# Altium project SYNCBOX_V3I1.PrjPcb (part 2 of 5)

## Sheet [05] - POWER.SchDoc
size A2; Organization: Altium Limited; Address1: L3, 12a Rodborough Rd; Address2: Frenchs Forest; Address3: NSW; Address4: Australia 2086; DocumentNumber: 5; SheetNumber: 5; SheetTotal: 11
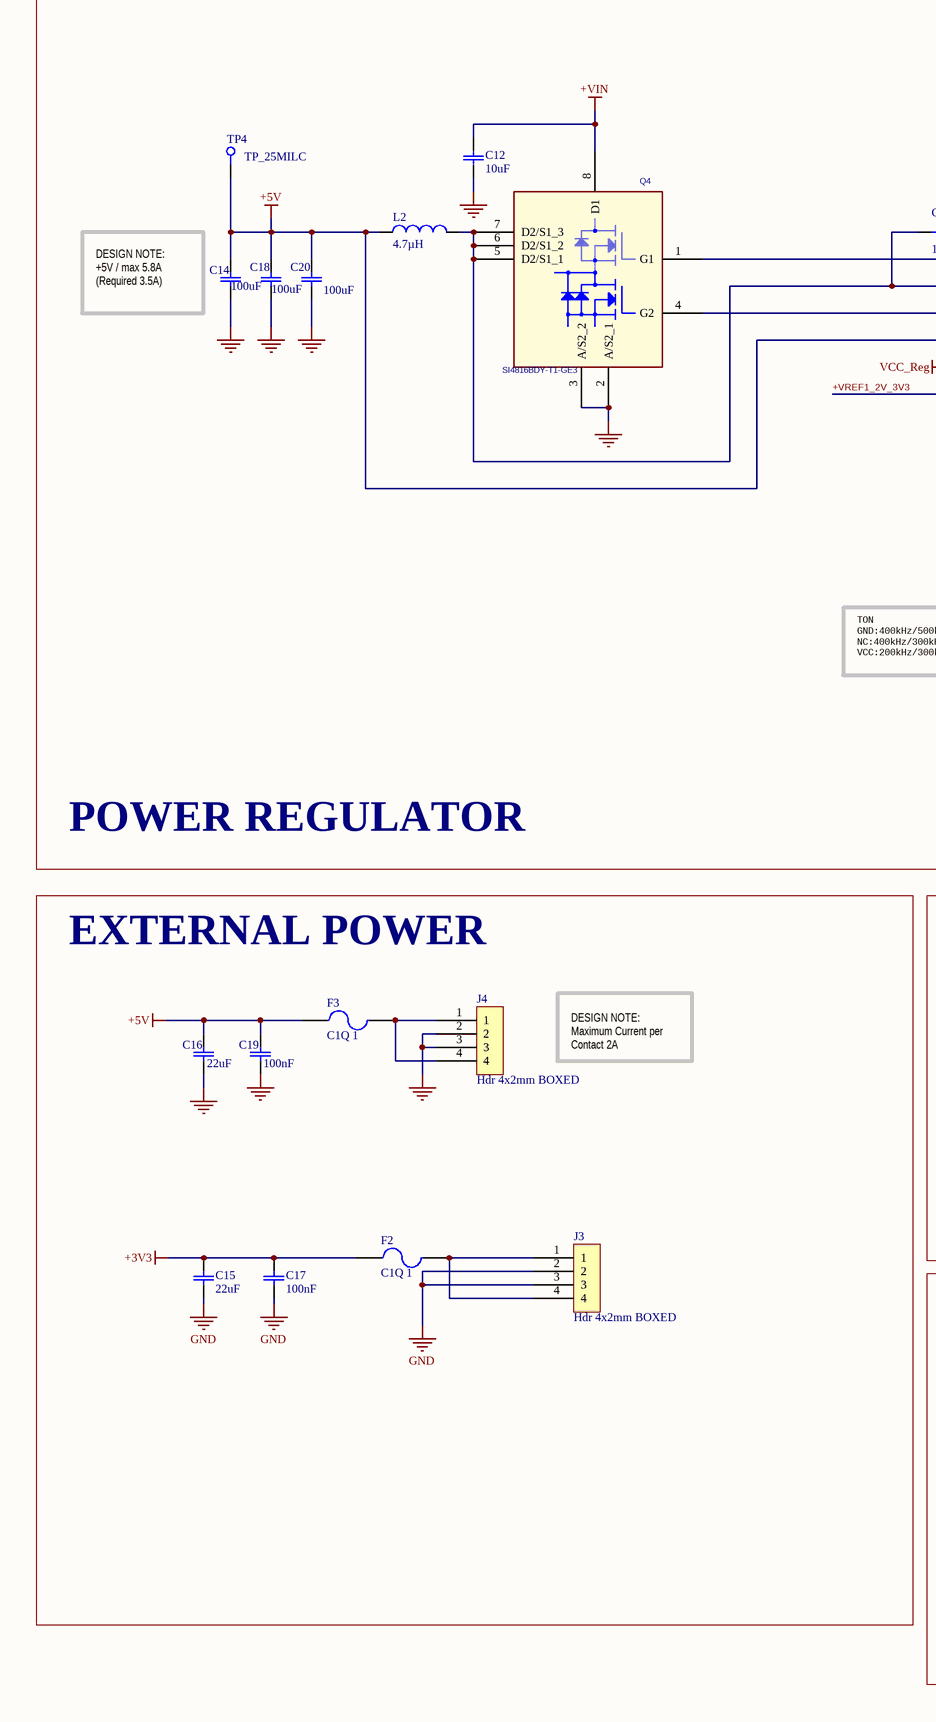
[diagram p4: [05] - POWER.SchDoc, left]
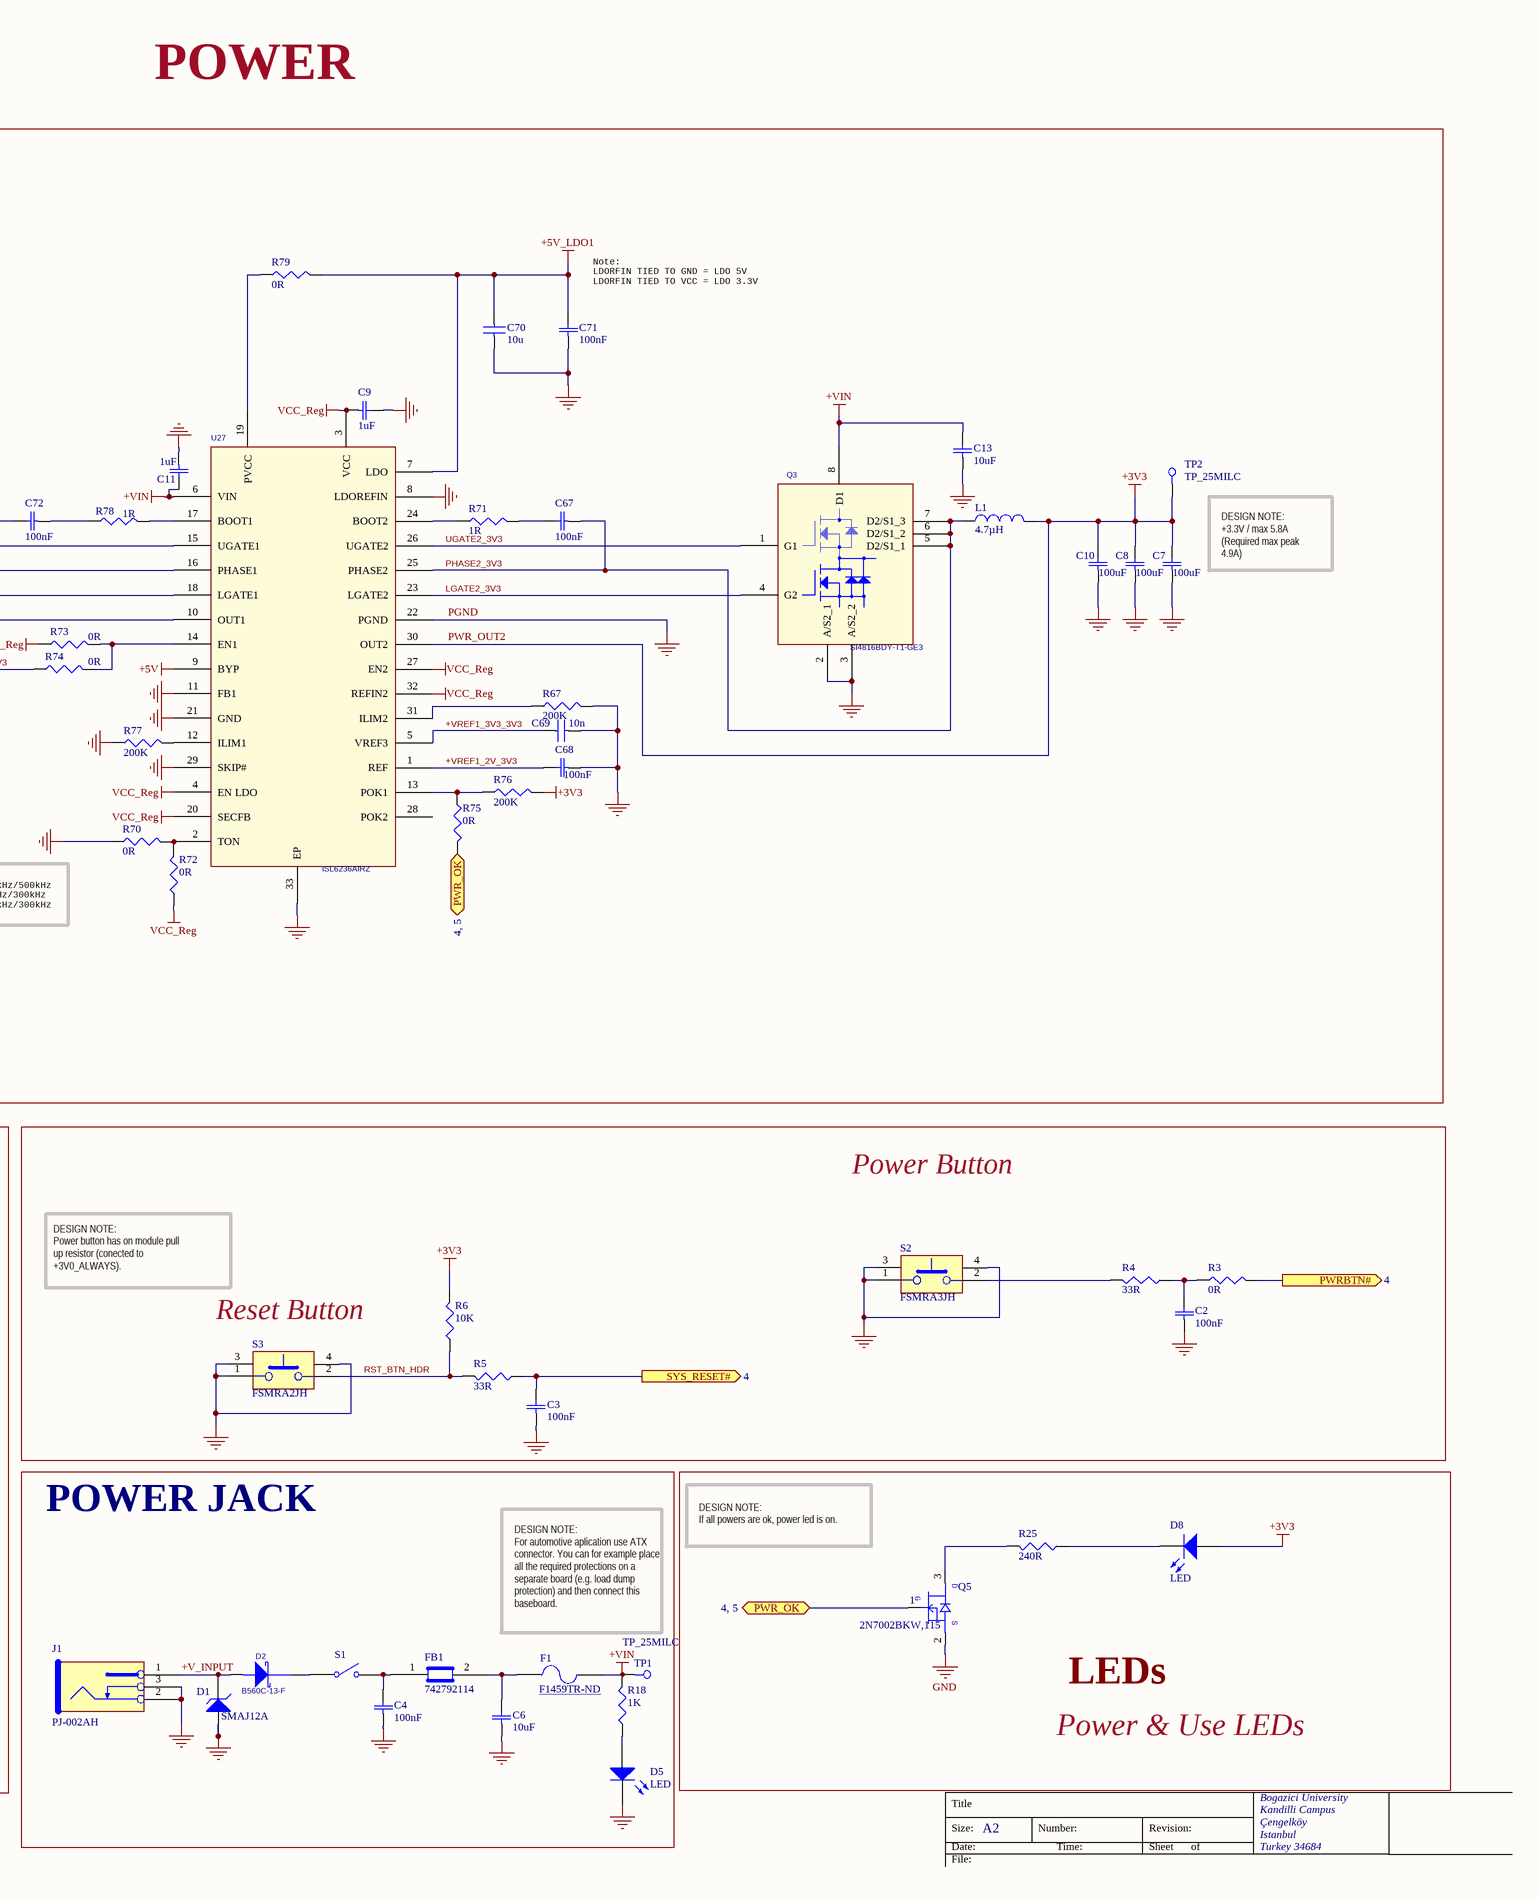
[diagram p5: [05] - POWER.SchDoc, right]

### Parts
(Parts that share a designator on the sheet are numbered #1, #2 ... from top to bottom, then left to right.)
C2#2  100nF  [C0402]
C3#2  100nF  [C0402]
C4#2  100nF  [C0402]
C6#2  10uF  [CAP_3216]
C7#2  100uF  [C1210C]
C8  100uF  [C1210C]
C9  1uF  [CAP_3216]
C10  100uF  [C1210C]
C11  1uF  [CAP_3216]
C12  10uF  [CAP_3216]
C13  10uF  [CAP_3216]
C14  100uF  [C1210C]
C15  22uF  [C0805]
C16  22uF  [C0805]
C17  100nF  [C0402]
C18  100uF  [C1210C]
C19  100nF  [C0402]
C20  100uF  [C1210C]
C67  100nF  [C0402]
C68  100nF  [C0402]
C69  10n  [C0402]
C70  10u  [C0603]
C71  100nF  [C0402]
C72  100nF  [C0402]
D1#2  SMAJ12A  [SMA / DO-214AC]
D2#2  B560C-13-F  [SMC]
D5  LED  [D0603_Directional]
D8  LED  [D0603_Directional]
F1  F1459TR-ND  [0466Series]
F2  C1Q 1  [C1]
F3  C1Q 1  [C1]
FB1  742792114  [Ferrite bead]
J1#2  PJ-002AH  [POWER_JACK_5.5_2.1MM_NS]
J3  Hdr 4x2mm BOXED  [HDR_1x4_2MM_SHDR]
J4  Hdr 4x2mm BOXED  [HDR_1x4_2MM_SHDR]
L1  4.7µH  [IHLP_255MILx270MIL]
L2  4.7µH  [IHLP_255MILx270MIL]
Q3  SI4816BDY-T1-GE3  [8_SOIC_3.9MM]
Q4  SI4816BDY-T1-GE3  [8_SOIC_3.9MM]
Q5  2N7002BKW,115  [SC70_SOT323]
R3#2  0R  [R0402]
R4#2  33R  [R0402]
R5#2  33R  [R0402]
R6  10K  [R0402]
R18  1K  [R0402]
R25  240R  [R0402]
R67  200K  [R0402]
R70  0R  [R0402]
R71  1R  [R0402]
R72  0R  [R0402]
R73  0R  [R0402]
R74  0R  [R0402]
R75  0R  [R0402]
R76  200K  [R0402]
R77  200K  [R0402]
R78  1R  [R0402]
R79  0R  [R0402]
S1#2  R1966ABLKBLKGR  [RockerSwitch]  (value not drawn)
S2  FSMRA3JH  [FSMRA3JH]
S3  FSMRA2JH  [FSMRA2JH]
TP1  TP_25MILC  [TP_25C]  (no BOM)
TP2  TP_25MILC  [TP_25C]  (no BOM)
TP4  TP_25MILC  [TP_25C]  (no BOM)
U27  ISL6236AIRZ  [32_VFQFN_EXPOSED_PAD]

### Blocks framed on the sheet
POWER REGULATOR: C7#2 C8-C14 C18 C20 C67-C72 L1 L2 Q3 Q4 R67 R70-R79 TP2 TP4 U27
EXTERNAL POWER: C15-C17 C19 F2 F3 J3 J4
POWER JACK: C4#2 C6#2 D1#2 D2#2 D5 F1 FB1 J1#2 R18 S1#2 TP1
LEDs: D8 Q5 R25

### Ports
PWR_OK (bidir, see 4, 5), PWRBTN# (out, see 4), SYS_RESET# (out, see 4)

### Nets
+5V: C14.2 C16.2 C18.2 C19.2 C20.2 F3.1 L2.1 TP4.1 U27.9(BYP) U27.10(OUT1)
+5V_LDO1: C70.1 C71.2 R79.2 U27.7(LDO)
+VIN: C11.2 C12.2 C13.2 F1.2 Q3.8(D1) Q4.8(D1) R18.2 TP1.1 U27.6(VIN)
GND: C2#2.1 C3#2.1 C4#2.1 C6#2.1 C7#2.1 C8.1 C9.2 C10.1 C11.1 C12.1 C13.1 C14.1 C15.1 C16.1 C17.1 C18.1 C19.1 C20.1 C68.1 C69.2 C70.2 C71.1 D1#2.1(A) D5.2(K) J1#2.2 J1#2.3 J3.2 J3.3 J4.2 J4.3 Q3.2(A/S2_1) Q3.3(A/S2_2) Q4.2(A/S2_1) Q4.3(A/S2_2) Q5.2(SOURCE) R67.2 R70.1 R77.1 S2.1 S2.3(MECH1) S2.4(MECH2) S3.1 S3.3(MECH1) S3.4(MECH2) U27.8(LDOREFIN) U27.11(FB1) U27.21(GND) U27.22(PGND) U27.29(SKIP#) U27.33(EP)  [also labelled PGND]
PWR_OUT2: C7#2.2 C8.2 C10.2 C15.2 C17.2 D8.1(A) F2.1 L1.2 R6.2 R76.2 TP2.1 U27.30(OUT2)  [also labelled +3V3]
VCC_Reg: C9.1 R72.1 R73.1 U27.3(VCC) U27.4(EN_LDO) U27.20(SECFB) U27.27(EN2) U27.32(REFIN2)
+V_INPUT: D1#2.2(K) D2#2.2(ANODE) J1#2.1
+VREF1_2V_3V3: C68.2 R74.1 U27.1(REF)
+VREF1_3V3_3V3: C69.1 U27.5(VREF3)
LGATE2_3V3: Q3.4(G2) U27.23(LGATE2)
PHASE2_3V3: C67.1 L1.1 Q3.5(D2/S1_1) Q3.6(D2/S1_2) Q3.7(D2/S1_3) U27.25(PHASE2)
RST_BTN_HDR: R5#2.2 R6.1 S3.2
UGATE2_3V3: Q3.1(G1) U27.26(UGATE2)
NetC2#2_2: C2#2.2 R3#2.1 R4#2.1
NetC3#2_2: C3#2.2 R5#2.1 ; port SYS_RESET#
NetC4#2_2: C4#2.2 FB1.1 S1#2.2(NO)
NetC6#2_2: C6#2.2 F1.1 FB1.2
NetC67_2: C67.2 R71.2
NetC72_1: C72.1 R78.1
NetC72_2: C72.2 L2.2 Q4.5(D2/S1_1) Q4.6(D2/S1_2) Q4.7(D2/S1_3) U27.16(PHASE1)
NetD2#2_1: D2#2.1(cathode) S1#2.1(COMMON)
NetD5_1: D5.1(A) R18.1
NetD8_2: D8.2(K) R25.1
NetF2_2: F2.2 J3.1 J3.4
NetF3_2: F3.2 J4.1 J4.4
NetJ8#1_B12: R3#2.2 ; port PWRBTN#
NetJ8#1_B24: Q5.1(GATE) R75.2 ; port PWR_OK
NetQ4_1: Q4.1(G1) U27.15(UGATE1)
NetQ4_4: Q4.4(G2) U27.18(LGATE1)
NetQ5_3: Q5.3(DRAIN) R25.2
NetR4#2_2: R4#2.2 S2.2
NetR67_1: R67.1 U27.31(ILIM2)
NetR70_2: R70.2 R72.2 U27.2(TON)
NetR71_1: R71.1 U27.24(BOOT2)
NetR73_2: R73.2 R74.2 U27.14(EN1)
NetR75_1: R75.1 R76.1 U27.13(POK1)
NetR77_2: R77.2 U27.12(ILIM1)
NetR78_2: R78.2 U27.17(BOOT1)
NetR79_1: R79.1 U27.19(PVCC)

Not connected (* = marked no-connect by the designer): U27 28(POK2)

### Notes on the sheet
- POWER
- (near C71) Note:
  LDORFIN TIED TO GND = LDO 5V
  LDORFIN TIED TO VCC = LDO 3.3V
- DESIGN NOTE:
  +3.3V / max 5.8A
  (Required max peak 4.9A)
- (near C14) DESIGN NOTE:
  +5V / max 5.8A
  (Required 3.5A)
- TON
  GND:400kHz/500kHz
  NC:400kHz/300kHz
  VCC:200kHz/300kHz
- Power Button
- DESIGN NOTE:
  Maximum Current per Contact 2A
- DESIGN NOTE:
  Power button has on module pull
  up resistor (conected to
  +3V0_ALWAYS).
- (near S3) Reset Button
- DESIGN NOTE:
  If all powers are ok, power led is on.
- DESIGN NOTE:
  For automotive aplication use ATX connector. You can for example place all the required protections on a separate board (e.g. load dump protection) and then connect this baseboard.
- Power & Use LEDs
- Title
- Bogazici University
- Size:
- Date:
- File:
- A2
- Number:
- Time:
- Revision:
- Sheet
- of
- Kandilli Campus
- Çengelköy
- Istanbul
- Turkey 34684
- (in symbol 2N7002BKW,115) D; G; S

### Library data of the parts
C2#2 C3#2 C4#2 C17 C19 C67 C68 C71 C72 = CL05A104KA5NNNC: CAP CER 0.1UF 50V X8R 0603; Manufacturer 1: Samsung Electro-Mechanics; Voltage - Rated: 25V; Tolerance: ±10%; Temperature Coefficient: X5R; Notification: Current market demand for these product types have resulted in fluctuating and extending lead times. Lead times may differ.; Description 1: CAP CER 0.1UF 25V X5R 0402; Category: Capacitors; Operating Temperature: -55°C ~ 85°C; Package / Case: 0402 (1005 Metric); Supplier 1: Digi-Key; Supplier Part Number 1: 1276-1043-6-ND; RoHS: RoHS Compliant; Stock 1: 100000; Pricing 1: 1=0.1, 10=0.04, 100=0.0176, 500=0.0126, 1000=0.0099, 2500=0.009, 5000=0.00828 (USD); Mounting Type: Surface Mount, MLCC; Applications: General Purpose; Ratings: -; Size / Dimension: 0.039" L x 0.020" W (1.00mm x 0.50mm); Height - Seated (Max): -; Thickness (Max): 0.022" (0.55mm); Lead Spacing: -; Features: -; Packaging: Digi-Reel®; Lead Style: -; ComponentLink1URL: http://www.samsungsem.com/kr/support/product-search/mlcc/CL05A104KA5NNNC.jsp; ComponentLink1Description: http://www.samsungsem.com/kr/support/product-search/mlcc/CL05A104KA5NNNC.jsp; Manufacturer Part Number 1: CL05A104KA5NNNC; Part Status: Active
C6#2 C12 C13 = C3216JB1V106K160: CAP CER 10UF 35V JB 1206; Manufacturer_Part_Number: C3216JB1V106K160AB; Manufacturer 1: TDK Corporation; Tolerance: ±10%; Vendor: TDK; Built_By: EMA_UL_Team; Type: DEV; C: Copyright (C) 2015 Accelerated Designs. All rights reserved; Notification: Current market demand for these product types have resulted in fluctuating and extending lead times. Lead times may differ.; Category: Capacitors; Operating Temperature: -25°C ~ 85°C; Package / Case: 1206 (3216 Metric); Value: Value; Voltage - Rated: 35V; Supplier 1: Digi-Key; Supplier Part Number 1: 445-11736-1-ND; RoHS: RoHS Compliant; Stock 1: 5285; Pricing 1: 1=0.92, 10=0.648, 100=0.4269, 500=0.31626, 1000=0.26881 (USD); Temperature Coefficient: JB; Mounting Type: Surface Mount, MLCC; Applications: General Purpose; Ratings: -; Size / Dimension: 0.126" L x 0.063" W (3.20mm x 1.60mm); Height - Seated (Max): -; Thickness (Max): 0.069" (1.75mm); Lead Spacing: -; Features: Low ESL; Packaging: Cut Tape (CT); Lead Style: -; ComponentLink1URL: https://product.tdk.com/info/en/catalog/datasheets/mlcc_commercial_general_en.pdf; ComponentLink1Description: https://product.tdk.com/info/en/catalog/datasheets/mlcc_commercial_general_en.pdf; RefDes: RefDes; Manufacturer Part Number 1: C3216JB1V106K160AB; Part Status: Active; Failure Rate: -; Description 1: CAP CER 10UF 35V JB 1206
C7#2 C8 C10 C14 C18 C20 = CL32A107MPVNNNE: CAP CER 100UF 10V X5R 1210; Manufacturer_Part_Number: C1210C107M8PACTU; Manufacturer 1: Samsung Electro-Mechanics; Tolerance: ±20%; Vendor: Kemet; Built_By: EMA_UL_Team; Type: DEV; C: Copyright (C) 2015 Accelerated Designs. All rights reserved; Notification: Current market demand for these product types have resulted in fluctuating and extending lead times. Lead times may differ.; Category: Capacitors; Operating Temperature: -55°C ~ 85°C; Package / Case: 1210 (3225 Metric); Value: 100uF; Voltage - Rated: 10V; Supplier 1: Digi-Key; Supplier Part Number 1: 1276-3364-1-ND; RoHS: RoHS Compliant; Stock 1: 10000; Pricing 1: 1=1.23, 10=0.97, 100=0.7277, 500=0.54984 (USD); Temperature Coefficient: X5R; Mounting Type: Surface Mount, MLCC; Applications: General Purpose; Ratings: -; Size / Dimension: 0.126" L x 0.098" W (3.20mm x 2.50mm); Height - Seated (Max): -; Thickness (Max): 0.110" (2.80mm); Lead Spacing: -; Features: -; Packaging: Cut Tape (CT); Lead Style: -; ComponentLink1URL: http://www.samsungsem.com/kr/support/product-search/mlcc/CL32A107MPVNNNE.jsp; ComponentLink1Description: http://www.samsungsem.com/kr/support/product-search/mlcc/CL32A107MPVNNNE.jsp; RefDes: RefDes; Manufacturer Part Number 1: CL32A107MPVNNNE; Part Status: Active; Description 1: CAP CER 100UF 10V X5R 1210
C9 = CGA5L3X8R1H105K1: CAP CER 1UF 50V X8R 1206; Manufacturer_Part_Number: CGA5L3X8R1H105K160AB; Manufacturer 1: TDK Corporation; Vendor: TDK; Built_By: EMA_UL_Team; Type: DEV; C: Copyright (C) 2015 Accelerated Designs. All rights reserved; Tolerance: ±10%; RefDes: RefDes; Value: Value; Manufacturer Part Number 1: CGA5L3X8R1H105K160AB; RoHS: RoHS Compliant; Stock 1: 3285; Pricing 1: 1=0.85, 10=0.628, 100=0.4306, 500=0.34086, 1000=0.28704 (USD); Packaging: Cut Tape (CT); Part Status: Active; Voltage - Rated: 50V; Temperature Coefficient: X8R; Operating Temperature: -55°C ~ 150°C; Features: High Temperature; Ratings: AEC-Q200; Applications: Automotive; Failure Rate: -; Mounting Type: Surface Mount, MLCC; Package / Case: 1206 (3216 Metric); Size / Dimension: 0.126" L x 0.063" W (3.20mm x 1.60mm); Height - Seated (Max): -; Thickness (Max): 0.071" (1.80mm); Lead Spacing: -; Lead Style: -; ComponentLink1URL: https://product.tdk.com/info/en/catalog/datasheets/mlcc_automotive_hightemp_en.pdf; ComponentLink1Description: https://product.tdk.com/info/en/catalog/datasheets/mlcc_automotive_hightemp_en.pdf; Supplier 1: Digi-Key; Supplier Part Number 1: 445-13000-1-ND; Description 1: CAP CER 1UF 50V X8R 1206; Category: Capacitors
C11 = CGA5L3X8R1H105K1: CAP CER 1UF 50V X8R 1206; Manufacturer_Part_Number: CGA5L3X8R1H105K160AB; Manufacturer 1: TDK Corporation; Tolerance: ±10%; Vendor: TDK; Built_By: EMA_UL_Team; Type: DEV; C: Copyright (C) 2015 Accelerated Designs. All rights reserved; Category: Capacitors; Operating Temperature: -55°C ~ 150°C; Package / Case: 1206 (3216 Metric); Value: Value; Voltage - Rated: 50V; Supplier 1: Digi-Key; Supplier Part Number 1: 445-13000-1-ND; RoHS: RoHS Compliant; Stock 1: 3285; Pricing 1: 1=0.85, 10=0.628, 100=0.4306, 500=0.34086, 1000=0.28704 (USD); Temperature Coefficient: X8R; Mounting Type: Surface Mount, MLCC; Applications: Automotive; Ratings: AEC-Q200; Size / Dimension: 0.126" L x 0.063" W (3.20mm x 1.60mm); Height - Seated (Max): -; Thickness (Max): 0.071" (1.80mm); Lead Spacing: -; Features: High Temperature; Packaging: Cut Tape (CT); Lead Style: -; ComponentLink1URL: https://product.tdk.com/info/en/catalog/datasheets/mlcc_automotive_hightemp_en.pdf; ComponentLink1Description: https://product.tdk.com/info/en/catalog/datasheets/mlcc_automotive_hightemp_en.pdf; RefDes: RefDes; Manufacturer Part Number 1: CGA5L3X8R1H105K160AB; Part Status: Active; Failure Rate: -; Description 1: CAP CER 1UF 50V X8R 1206
C15 C16 = CL21A226MOCLRNC: CAP CER 22UF 16V X5R 0805; Manufacturer 1: Samsung Electro-Mechanics; Tolerance: ±20%; Notification: Current market demand for these product types have resulted in fluctuating and extending lead times. Lead times may differ.; Supplier 1: Digi-Key; Supplier Part Number 1: 1276-6780-1-ND; RoHS: RoHS Compliant; Category: Capacitors; Stock 1: 40000; Pricing 1: 1=0.34, 10=0.233, 100=0.132, 500=0.09318, 1000=0.08153 (USD); Voltage - Rated: 16V; Temperature Coefficient: X5R; Mounting Type: Surface Mount, MLCC; Operating Temperature: -55°C ~ 85°C; Applications: General Purpose; Ratings: -; Package / Case: 0805 (2012 Metric); Size / Dimension: 0.079" L x 0.049" W (2.00mm x 1.25mm); Height - Seated (Max): -; Thickness (Max): 0.037" (0.95mm); Lead Spacing: -; Features: Low Profile; Packaging: Cut Tape (CT); Lead Style: -; ComponentLink1URL: http://www.samsungsem.com/kr/support/product-search/mlcc/CL21A226MOCLRNC.jsp; ComponentLink1Description: http://www.samsungsem.com/kr/support/product-search/mlcc/CL21A226MOCLRNC.jsp; Manufacturer Part Number 1: CL21A226MOCLRNC; Part Status: Active; Description 1: CAP CER 22UF 16V X5R 0805
C69 = C1005X7R1C103K: CAP CER 10000PF 16V X7R 10% 0402; Manufacturer: TDK Corporation; Value: 10nF; .Checked PCB: CHK; Capacitance: 10000pF; Category: Capacitors; Manufacturer Part Number: C1005X7R1C103K; Operating Temperature: -55°C ~ 125°C; Package / Case: 0402 (1005 Metric); Price 1k [$]: 0.00416; .Checked SCH: CHK; Voltage - Rated: 16V; Supplier Part Number: 445-1262-1-ND; Supplier: Digikey; Supplier 1: Digi-Key; Supplier Part Number 1: 445-1262-1-ND; RoHS: RoHS Compliant; Stock 1: 511497; Pricing 1: 1=0.08, 10=0.05, 100=0.018, 250=0.013, 500=0.0096, 1000=0.0065 (USD); Tolerance: ±10%; Temperature Coefficient: X7R; Mounting Type: Surface Mount, MLCC; Applications: General Purpose; Ratings: -; Size / Dimension: 0.039" L x 0.020" W (1.00mm x 0.50mm); Height - Seated (Max): -; Thickness (Max): 0.022" (0.55mm); Lead Spacing: -; Features: -; Packaging: Cut Tape (CT); Lead Style: -; ComponentLink1URL: http://www.tdk.co.jp/tefe02/e412_c.pdf; ComponentLink1Description: http://www.tdk.co.jp/tefe02/e412_c.pdf
C70 = C1608X5R0J106M: CAP CER 10UF 6.3V X5R 20% 0603; Manufacturer: TDK Corporation; Capacitance: 10µF; Value: 10µF; .Checked PCB: CHK; Category: Capacitors; Manufacturer Part Number: C1608X5R0J106M; Operating Temperature: -55°C ~ 85°C; Package / Case: 0603 (1608 Metric); Price 1k [$]: 0.08580; .Checked SCH: CHK; Voltage - Rated: 6.3V; Features: Low ESR; Supplier Part Number: 445-4112-1-ND; Supplier: Digikey; Supplier 1: Digi-Key; Supplier Part Number 1: 445-4112-1-ND; RoHS: RoHS Compliant; Stock 1: 48157; Pricing 1: 1=0.46, 10=0.363, 100=0.1898, 250=0.14024, 500=0.1089, 1000=0.0858 (USD); Tolerance: ±20%; Temperature Coefficient: X5R; Mounting Type: Surface Mount, MLCC; Applications: General Purpose; Ratings: -; Size / Dimension: 0.063" L x 0.031" W (1.60mm x 0.80mm); Height - Seated (Max): -; Thickness (Max): 0.037" (0.95mm); Lead Spacing: -; Packaging: Cut Tape (CT); Lead Style: -; ComponentLink1URL: http://www.tdk.com/pdf/general_B11.pdf; ComponentLink1Description: http://www.tdk.com/pdf/general_B11.pdf
D1#2 = SMAJ12A: TVS DIODE 12V 19.9V SMA; Manufacturer 1: Bourns Inc.; Type: Zener; Voltage - Breakdown (Min): 13.3V; Current - Peak Pulse (10/1000µs): 20.1A; Power - Peak Pulse: 400W; Power Line Protection: No; Supplier 1: Digi-Key; RoHS: RoHS Compliant; Category: Circuit Protection; Stock 1: 20326; Pricing 1: 1=0.47, 10=0.329, 25=0.27, 100=0.216, 250=0.15712, 500=0.12766, 1000=0.0982, 2500=0.08838 (USD); Packaging: Cut Tape (CT); Part Status: Active; Voltage - Reverse Standoff (Typ): 12V; Voltage - Clamping (Max) @ Ipp: 19.9V; Applications: General Purpose; Capacitance @ Frequency: -; Operating Temperature: -55°C ~ 150°C (TJ); Mounting Type: Surface Mount; Package / Case: DO-214AC, SMA; Supplier Device Package: SMA (DO-214AC); ComponentLink1URL: https://www.bourns.com/docs/Product-Datasheets/SMAJ.pdf; ComponentLink1Description: https://www.bourns.com/docs/Product-Datasheets/SMAJ.pdf; Supplier Part Number 1: SMAJ12ABCT-ND; Published: 8-Jun-2000; LatestRevisionDate: 17-Jul-2002; LatestRevisionNote: Re-released for DXP Platform.; PackageReference: DIODE-0.7; Publisher: Altium Limited; PackageDescription: Diode, Thru-Hole; 2 Leads; 0.7 in Pin Spacing; Manufacturer Part Number 1: SMAJ12A; Description 1: TVS DIODE 12V 19.9V SMA
D2#2 = B560C-13-F: DIODE SCHOTTKY 60V 5A SMC; Manufacturer: Diodes Inc; .Checked PCB: CHK; Voltage - Forward (Vf) (Max) @ If: 700mV @ 5A; Speed: Fast Recovery =< 500ns, > 200mA (Io); Current - Reverse Leakage @ Vr: 500µA @ 60V; Capacitance @ Vr, F: 300pF @ 4V, 1MHz; .Checked SCH: CHK; Category: Discrete Semiconductor Products; Supplier Part Number: B560C-FDICT-ND; Manufacturer Part Number: B560C-13-F; Price 1k [$]: 0.42900; Value: B560C-13-F; Package / Case: DO-214AB, SMC; Supplier: Digikey; Family: Diodes, Rectifiers - Single; Voltage - DC Reverse (Vr) (Max): 60V; Current - Average Rectified (Io): 5A; Diode Type: Schottky; Supplier 1: Digi-Key; Supplier Part Number 1: B560C-FDICT-ND; RoHS: RoHS Compliant; Stock 1: 37770; Pricing 1: 1=0.99, 10=0.884, 100=0.702, 250=0.611, 500=0.546, 1000=0.429 (USD); Reverse Recovery Time (trr): -; Mounting Type: Surface Mount; Supplier Device Package: SMC; Packaging: Cut Tape (CT); ComponentLink1URL: http://www.diodes.com/datasheets/ds13012.pdf; ComponentLink1Description: http://www.diodes.com/datasheets/ds13012.pdf
D5 D8 = LW Q38E-Q1OO-3K6L-1: LED COOL WHITE DIFFUSED 0603 SMD; Manufacturer 1: OSRAM Opto Semiconductors Inc.; Color: White, Cool; Lens Color: Yellow; Millicandela Rating: 81mcd; Lens Style/Size: Rectangle with Flat Top, 1.10mm x 0.80mm; Voltage - Forward (Vf) (Typ): 2.85V; Current - Test: 5mA; Viewing Angle: 150°, 130°; Wavelength - Dominant: 8200K; Supplier 1: Digi-Key; Supplier Part Number 1: 475-2831-1-ND; Manufacturer Part Number 1: LW Q38E-Q1OO-3K6L-1; RoHS: RoHS Compliant; Description 1: LED COOL WHITE DIFFUSED 0603 SMD; Category: Optoelectronics; Stock 1: 215520; Pricing 1: 1=0.49, 10=0.354, 25=0.2888, 100=0.231, 250=0.19492, 500=0.16604, 1000=0.12994 (USD); Packaging: Cut Tape (CT); Part Status: Active; Lens Transparency: Diffused; Mounting Type: Surface Mount; Wavelength - Peak: -; Features: -; Package / Case: 0603 (1608 Metric); Supplier Device Package: 0603; Size / Dimension: 1.60mm L x 0.80mm W; Height (Max): 0.40mm; ComponentLink1URL: https://dammedia.osram.info/media/resource/hires/osram-dam-2493068/LW%20Q38E.pdf; ComponentLink1Description: https://dammedia.osram.info/media/resource/hires/osram-dam-2493068/LW%20Q38E.pdf
F1 = 0466004.NR: FUSE BOARD MNT 4A 32VAC/VDC 1206; Manufacturer 1: Littelfuse Inc.; Manufacturer Part Number 1: 0466004.NRHF; Fuse Type: Board Mount (Cartridge Style Excluded); Response Time: Fast; Breaking Capacity @ Rated Voltage: 50A; Approvals: CSA, UL; Supplier 1: Digi-Key; Supplier Part Number 1: F6018DKR-ND; RoHS: RoHS Compliant; Description 1: FUSE BOARD MNT 4A 32VAC/VDC 1206; Category: Circuit Protection; Stock 1: 4728; Pricing 1: 1=0.84, 5=0.812, 10=0.787, 50=0.6618, 100=0.5493, 250=0.4994, 500=0.4245, 1000=0.37455 (USD); Packaging: Digi-Reel®; Part Status: Active; Package / Case: 1206 (3216 Metric); Mounting Type: Surface Mount; Operating Temperature: -55°C ~ 90°C; Color: -; Size / Dimension: 0.125" L x 0.060" W x 0.023" H (3.18mm x 1.52mm x 0.58mm); ComponentLink1URL: http://www.littelfuse.com/~/media/electronics/datasheets/fuses/littelfuse_fuse_466_datasheet.pdf.pdf; ComponentLink1Description: http://www.littelfuse.com/~/media/electronics/datasheets/fuses/littelfuse_fuse_466_datasheet.pdf.pdf
F2 F3 = C1Q 1: FUSE BOARD MOUNT 1A 125VAC 63VDC; Manufacturer 1: Bel Fuse Inc.; Fuse Type: Board Mount (Cartridge Style Excluded); Response Time: Fast; Breaking Capacity @ Rated Voltage: 100A AC, 50A DC; Approvals: CE, CSA, cULus; Supplier 1: Digi-Key; Supplier Part Number 1: 507-1077-1-ND; Manufacturer Part Number 1: C1Q 1; RoHS: RoHS Compliant; Description 1: FUSE BOARD MOUNT 1A 125VAC 63VDC; Category: Circuit Protection; Stock 1: 81500; Pricing 1: 1=0.33, 5=0.318, 10=0.304, 50=0.2714, 100=0.2526, 250=0.22452, 500=0.18712, 1000=0.17775 (USD); Packaging: Cut Tape (CT); Part Status: Active; Package / Case: 1206 (3216 Metric); Mounting Type: Surface Mount; Operating Temperature: -55°C ~ 125°C; Color: -; Size / Dimension: 0.126" L x 0.062" W x 0.023" H (3.20mm x 1.58mm x 0.58mm); ComponentLink1URL: https://belfuse.com/resources/datasheets/circuitprotection/ds-cp-c1q-series.pdf; ComponentLink1Description: https://belfuse.com/resources/datasheets/circuitprotection/ds-cp-c1q-series.pdf
FB1 = FB742792114: FERRITE BEAD 50 OHM 1206 1LN; Filter Type: Signal Line; Current Rating (Max): 3A; DC Resistance (DCR) (Max): 25 mOhm; .Checked PCB: CHK; Supplier 1: Digi-Key; Supplier Part Number 1: 732-1621-6-ND; Manufacturer 2: Wurth Electronics Inc.; Manufacturer Part Number 2: 742792114; RoHS: RoHS Compliant; Stock 2: 21934; Pricing 2: 1=0.24, 10=0.238, 50=0.219, 100=0.209, 500=0.2, 1000=0.19 (USD); Packaging: Cut Tape (CT); Part Status: Active; Ratings: -; Operating Temperature: -55°C ~ 125°C; Package / Case: 1206 (3216 Metric); Mounting Type: Surface Mount; Height (Max): 0.051" (1.30mm); Size / Dimension: 0.126" L x 0.063" W (3.20mm x 1.60mm); ComponentLink1URL: http://katalog.we-online.de/pbs/datasheet/742792114.pdf; ComponentLink1Description: http://katalog.we-online.de/pbs/datasheet/742792114.pdf; Supplier 2: Digi-Key; Supplier Part Number 2: 732-1621-1-ND; Description 2: FERRITE BEAD 50 OHM 1206 1LN; Category: Filters; .Checked SCH: CHK
J1#2 = PJ-002AH: CONN PWR JACK 2.1X5.5MM HIGH CUR; Manufacturer: CUI Inc; .Checked PCB: CHK; Mating connector: 2.1mm ID, 5.5mm OD; Gender: Male; Number of Positions/Contacts: 2 Conductors, 3 Contacts; Internal Switch(s): Single Switch, Normally Closed; Shielding: Unshielded; Voltage - Rated: 24VDC; Current Rating: 5A; .Checked SCH: CHK; Category: Connectors, Interconnects; Family: Barrel - Power; Manufacturer Part Number: PJ-002AH; Operating Temperature: -25°C ~ 85°C; Price 1k [$]: 0.23625; Supplier: Digikey; Supplier Part Number: CP-002AH-ND; Value: PJ-002AH; Supplier 1: Digi-Key; Supplier Part Number 1: CP-002AH-ND; RoHS: RoHS Compliant; Stock 1: 138933; Pricing 1: 1=1.01, 10=0.704, 100=0.4724, 500=0.3819, 1000=0.3417, 2500=0.27135 (USD); Connector Type: Jack; Plug/Mating Plug Diameter: 2.1mm ID, 5.5mm OD; Mounting Type: Through Hole, Right Angle; Termination: Solder Eyelet(s); Features: -; Color: Black; Contact Material: Copper Alloy; Contact Material - Plating: Nickel; Housing Color: Black; Housing Material: Thermoplastic; ComponentLink1URL: http://products.cui.com/GetSpecForDigiKey.aspx?MFGNum=PJ-002AH; ComponentLink1Description: http://products.cui.com/GetSpecForDigiKey.aspx?MFGNum=PJ-002AH
J3 J4 = 0532530470: CONN HEADER 4POS 2MM VERT TIN; Manufacturer: Molex Inc; Connector Type: Header, Shrouded; Number of Positions: 4; Number of Positions Loaded: All; Pitch: 0.079" (2.00mm); .Creator: MM; .Checked PCB: CHK; Supplier 1: Digi-Key; Manufacturer Part Number: 0532530470; RoHS: RoHS Compliant; Category: Connectors, Interconnects; Stock 1: 5160; Pricing 1: 1=0.23, 10=0.211, 50=0.1576, 100=0.1464, 250=0.12948, 500=0.12386, 1000=0.10134, 2500=0.0929, 5000=0.09008 (USD); Packaging: Tray; Contact Type: Male Pin; Number of Rows: 1; Row Spacing: -; Contact Mating Length: 0.130" (3.30mm); Mounting Type: Through Hole; Termination: Press-Fit; Fastening Type: -; Features: -; Contact Finish: Tin; Contact Finish Thickness: -; Color: -; ComponentLink1URL: http://www.molex.com/pdm_docs/sd/532530270_sd.pdf; ComponentLink1Description: http://www.molex.com/pdm_docs/sd/532530270_sd.pdf; Supplier Part Number 1: WM19006-ND; .Checked SCH: CHK
L1 L2 = IHLP2525CZER4R7M01: INDUCTOR POWER 4.7UH 5.5A SMD; Manufacturer: Vishay/Dale; .Checked PCB: CHK; Current - Saturation: 10A; Shielding: Shielded; DC Resistance (DCR): 40 mOhm Max; Tolerance: ±20%; Frequency - Test: 100kHz; .Checked SCH: CHK; Category: Inductors, Coils, Chokes; Manufacturer Part Number: IHLP2525CZER4R7M01; Operating Temperature: -55°C ~ 125°C; Package / Case: 0.270" L x 0.255" W x 0.118" H (6.86mm x 6.47mm x 3.00mm); Price 1k [$]: 1.09800; Value: 4.7µH; Inductance: 4.7µH; Current: 5.5A; Applications: General Purpose; Supplier Part Number: 541-1010-1-ND; Supplier: Digikey; Supplier 1: Digi-Key; Supplier Part Number 1: 541-1010-1-ND; RoHS: RoHS Compliant; Stock 1: 25684; Pricing 1: 1=2.26, 10=1.83, 100=1.525, 500=1.22, 1000=1.098 (USD); Current - Temperature Rise: 5.5A; Type: -; Q @ Freq: -; Frequency - Self Resonant: -; Material - Core: -; Mounting Type: Surface Mount; Packaging: Cut Tape (CT); ComponentLink1URL: http://www.vishay.com/doc?34104; ComponentLink1Description: http://www.vishay.com/doc?34104
Q3 Q4 = SI4816BDY-T1-GE3: MOSFET DL N-CH 30V 6.8A 8-SOIC; Manufacturer: Vishay/Siliconix; .Checked PCB: CHK; FET Type: 2 N-Channel (Dual); FET Feature: Logic Level Gate; Rds On (Max) @ Id, Vgs: 18.5 mOhm @ 6.8A, 10V; Current - Continuous Drain (Id) @ 25° C: 5.8A, 8.2A; Vgs(th) (Max) @ Id: 3V @ 250µA; Power - Max: 1W, 1.25W; Gate Charge (Qg) @ Vgs: 10nC @ 5V; .Checked SCH: CHK; Category: Discrete Semiconductor Products; Manufacturer Part Number: SI4816BDY-T1-GE3; Package / Case: 8-SOIC (0.154", 3.90mm Width); Price 1k [$]: 0.84800; Value: SI4816BDY-T1-GE3; Family: FETs - Arrays; Drain to Source Voltage (Vdss): 30V; Supplier Part Number: SI4816BDY-T1-GE3CT-ND; Supplier: Digikey; Supplier 1: Digi-Key; Supplier Part Number 1: SI4816BDY-T1-GE3CT-ND; RoHS: RoHS Compliant; Stock 1: 15735; Pricing 1: 1=1.84, 25=1.4228, 100=1.2912, 250=1.1594, 500=1.0013, 1000=0.8432 (USD); Input Capacitance (Ciss) @ Vds: -; Mounting Type: Surface Mount; Supplier Device Package: 8-SOICN; Packaging: Cut Tape (CT); ComponentLink1URL: http://www.vishay.com/docs/73026/si4816bd.pdf; ComponentLink1Description: http://www.vishay.com/docs/73026/si4816bd.pdf
Q5 = 2N7002BKW,115: MOSFET N-CH 60V 310MA SOT323; Manufacturer: NXP Semiconductors; FET Type: MOSFET N-Channel, Metal Oxide; FET Feature: Logic Level Gate; Rds On (Max) @ Id, Vgs: 1.6 Ohm @ 500mA, 10V; Vgs(th) (Max) @ Id: 2.1V @ 250µA; Gate Charge (Qg) @ Vgs: 0.6nC @ 4.5V; Input Capacitance (Ciss) @ Vds: 50pF @ 10V; Power - Max: 275mW; .Checked PCB: CHK; Supplier 1: Digi-Key; Supplier Part Number 1: 568-5980-1-ND; Manufacturer Part Number: 2N7002BKW,115; RoHS: RoHS Compliant; Category: Discrete Semiconductor Products; Stock 1: 15666; Pricing 1: 1=0.39, 10=0.354, 25=0.2548, 100=0.1983, 250=0.12456, 500=0.10616, 1000=0.07233 (USD); Drain to Source Voltage (Vdss): 60V; Current - Continuous Drain (Id) @ 25° C: 310mA; Mounting Type: Surface Mount; Package / Case: SC-70, SOT-323; Supplier Device Package: SC-70; Packaging: Cut Tape (CT); ComponentLink1URL: http://www.nxp.com/documents/data_sheet/2N7002BKW.pdf; ComponentLink1Description: http://www.nxp.com/documents/data_sheet/2N7002BKW.pdf; .Checked SCH: CHK
R3#2 R70 R72-R75 R79 = RC1005J000CS: RES SMD 0 OHM JUMPER 1/16W 0402; Manufacturer 1: Samsung Electro-Mechanics; Power (Watts): 0.063W, 1/16W; .Checked PCB: used; Category: Resistors; Package / Case: 0402 (1005 Metric); Tolerance: Jumper; .Checked SCH: used; Supplier 1: Digi-Key; Supplier Part Number 1: 1276-3480-6-ND; RoHS: RoHS Compliant; Stock 1: 9624698; Pricing 1: 1=0.1, 10=0.016, 25=0.0116, 50=0.009, 100=0.0066, 250=0.005, 500=0.004, 1000=0.00295, 5000=0.00211 (USD); Composition: Thick Film; Features: Moisture Resistant; Temperature Coefficient: -; Size / Dimension: 0.039" L x 0.020" W (1.00mm x 0.50mm); Packaging: Digi-Reel®; ComponentLink1URL: http://www.samsungsem.com/kr/support/product-search/chip-resistor/RC1005J000CS.jsp; ComponentLink1Description: http://www.samsungsem.com/kr/support/product-search/chip-resistor/RC1005J000CS.jsp; Manufacturer Part Number 1: RC1005J000CS; Part Status: Active; Operating Temperature: -55°C ~ 155°C; Supplier Device Package: 0402; Height - Seated (Max): 0.016" (0.40mm); Failure Rate: -; Description 1: RES SMD 0 OHM JUMPER 1/16W 0402
R4#2 R5#2 = ERJ-2RKF33R0X: RES SMD 33 OHM 1% 1/10W 0402; Manufacturer 1: Panasonic Electronic Components; Power (Watts): 0.1W, 1/10W; .Checked PCB: RF; Temperature Coefficient: ±100ppm/°C; Category: Resistors; Package / Case: 0402 (1005 Metric); Tolerance: ±1%; .Checked SCH: RF; Supplier 1: Digi-Key; Supplier Part Number 1: P33.0LDKR-ND; RoHS: RoHS Compliant; Stock 1: 459707; Pricing 1: 1=0.1, 10=0.056, 100=0.0227, 1000=0.01021, 2500=0.00886, 5000=0.00732 (USD); Composition: Thick Film; Features: Automotive AEC-Q200; Size / Dimension: 0.039" L x 0.020" W (1.00mm x 0.50mm); Packaging: Digi-Reel®; ComponentLink1URL: https://industrial.panasonic.com/cdbs/www-data/pdf/RDA0000/AOA0000C304.pdf; ComponentLink1Description: https://industrial.panasonic.com/cdbs/www-data/pdf/RDA0000/AOA0000C304.pdf; Manufacturer Part Number 1: ERJ-2RKF33R0X; Part Status: Active; Operating Temperature: -55°C ~ 155°C; Supplier Device Package: 0402; Height - Seated (Max): 0.016" (0.40mm); Failure Rate: -; Description 1: RES SMD 33 OHM 1% 1/10W 0402
R6 = RC1005F103CS: RES SMD 10K OHM 1% 1/16W 0402; Manufacturer 1: Samsung Electro-Mechanics; Power (Watts): 0.063W, 1/16W; .Checked PCB: used; Temperature Coefficient: ±100ppm/°C; Category: Resistors; Package / Case: 0402 (1005 Metric); Tolerance: ±1%; .Checked SCH: used; Supplier 1: Digi-Key; Supplier Part Number 1: 1276-3431-6-ND; RoHS: RoHS Compliant; Stock 1: 12738811; Pricing 1: 1=0.1, 10=0.021, 100=0.0087, 1000=0.00391, 2500=0.00339, 5000=0.0028 (USD); Composition: Thick Film; Features: Moisture Resistant; Size / Dimension: 0.039" L x 0.020" W (1.00mm x 0.50mm); Packaging: Digi-Reel®; ComponentLink1URL: http://www.samsungsem.com/kr/support/product-search/chip-resistor/RC1005F103CS.jsp; ComponentLink1Description: http://www.samsungsem.com/kr/support/product-search/chip-resistor/RC1005F103CS.jsp; Manufacturer Part Number 1: RC1005F103CS; Part Status: Active; Operating Temperature: -55°C ~ 155°C; Supplier Device Package: 0402; Height - Seated (Max): 0.016" (0.40mm); Failure Rate: -; Description 1: RES SMD 10K OHM 1% 1/16W 0402
R18 = ERJ-2RKF1001X: RES SMD 1K OHM 1% 1/10W 0402; Manufacturer 1: Panasonic Electronic Components; .Checked PCB: used; Power (Watts): 0.1W, 1/10W; Temperature Coefficient: ±100ppm/°C; .Checked SCH: used; Manufacturer Part Number 1: ERJ-2RKF1001X; RoHS: RoHS Compliant; Stock 1: 18630560; Pricing 1: 1=0.1, 10=0.056, 100=0.0227, 1000=0.01021, 2500=0.00886, 5000=0.00732 (USD); Packaging: Digi-Reel®; Part Status: Active; Tolerance: ±1%; Composition: Thick Film; Features: Automotive AEC-Q200; Operating Temperature: -55°C ~ 155°C; Package / Case: 0402 (1005 Metric); Supplier Device Package: 0402; Size / Dimension: 0.039" L x 0.020" W (1.00mm x 0.50mm); Height - Seated (Max): 0.016" (0.40mm); Failure Rate: -; ComponentLink1URL: https://industrial.panasonic.com/cdbs/www-data/pdf/RDA0000/AOA0000C304.pdf; ComponentLink1Description: https://industrial.panasonic.com/cdbs/www-data/pdf/RDA0000/AOA0000C304.pdf; Supplier 1: Digi-Key; Supplier Part Number 1: P1.00KLDKR-ND; Description 1: RES SMD 1K OHM 1% 1/10W 0402; Category: Resistors
R25 = RMCF0402FT240R: RES TF 240 OHM 1% 0.0625W 0402; Manufacturer: Stackpole Electronics Inc; Resistance (Ohms): 240; Power (Watts): 0.063W, 1/16W; .Checked PCB: CHK; Temperature Coefficient: ±100ppm/°C; Category: Resistors; Supplier Part Number: RMCF0402FT240RCT-ND; Manufacturer Part Number: RMCF0402FT240R; Package / Case: 0402 (1005 Metric); Price 1k [$]: 0.00384; Tolerance: ±1%; Value: 240R; .Checked SCH: CHK; Supplier: Digikey; Supplier 1: Digi-Key; Supplier Part Number 1: RMCF0402FT240RCT-ND; RoHS: RoHS Compliant; Stock 1: 39860; Pricing 1: 1=0.04, 10=0.025, 50=0.0138, 100=0.0105, 250=0.0078, 500=0.00576, 1000=0.00384 (USD); Composition: Thick Film; Features: -; Size / Dimension: 0.039" L x 0.020" W (1.00mm x 0.50mm); Height: 0.016" (0.40mm); Number of Terminations: 2; Packaging: Cut Tape (CT); ComponentLink1URL: http://www.seielect.com/Catalog/SEI-RMCF.pdf; ComponentLink1Description: http://www.seielect.com/Catalog/SEI-RMCF.pdf
R67 R76 R77 = RC1005F204CS: RES SMD 200K OHM 1% 1/16W 0402; Manufacturer 1: Samsung Electro-Mechanics; Power (Watts): 0.063W, 1/16W; .Checked PCB: used; Temperature Coefficient: ±100ppm/°C; Category: Resistors; Package / Case: 0402 (1005 Metric); Tolerance: ±1%; .Checked SCH: used; Supplier 1: Digi-Key; Supplier Part Number 1: 1276-3449-6-ND; RoHS: RoHS Compliant; Stock 1: 325433; Pricing 1: 1=0.1, 10=0.021, 100=0.0087, 1000=0.00391, 2500=0.00339, 5000=0.0028 (USD); Composition: Thick Film; Features: Moisture Resistant; Size / Dimension: 0.039" L x 0.020" W (1.00mm x 0.50mm); Packaging: Digi-Reel®; ComponentLink1URL: http://www.samsungsem.com/kr/support/product-search/chip-resistor/RC1005F204CS.jsp; ComponentLink1Description: http://www.samsungsem.com/kr/support/product-search/chip-resistor/RC1005F204CS.jsp; Manufacturer Part Number 1: RC1005F204CS; Part Status: Active; Operating Temperature: -55°C ~ 155°C; Supplier Device Package: 0402; Height - Seated (Max): 0.016" (0.40mm); Failure Rate: -; Description 1: RES SMD 200K OHM 1% 1/16W 0402
R71 R78 = RC0402FR-071RL: RES 1.00 OHM 1/16W 1% 0402 SM; Manufacturer: Yageo; Resistance (Ohms): 1; Power (Watts): 0.063W, 1/16W; .Checked PCB: CHK; Temperature Coefficient: ±200ppm/°C; Category: Resistors; Manufacturer Part Number: RC0402FR-071RL; Package / Case: 0402 (1005 Metric); Price 1k [$]: 0.01421; Tolerance: ±1%; Value: 1R; .Checked SCH: CHK; Supplier Part Number: 311-1.00LRCT-ND; Supplier: Digikey; Supplier 1: Digi-Key; Supplier Part Number 1: 311-1.00LRCT-ND; RoHS: RoHS Compliant; Stock 1: 347765; Pricing 1: 10=0.019, 50=0.0142, 100=0.0109, 250=0.00808, 500=0.00596, 1000=0.00397 (USD); Composition: Thick Film; Features: -; Size / Dimension: 0.039" L x 0.020" W (1.00mm x 0.50mm); Height: 0.016" (0.40mm); Number of Terminations: 2; Packaging: Cut Tape (CT); ComponentLink1URL: http://www.yageo.com/documents/recent/PYu-RC0402_51_RoHS_L_6.pdf; ComponentLink1Description: http://www.yageo.com/documents/recent/PYu-RC0402_51_RoHS_L_6.pdf
S1#2 = R1966ABLKBLKGR: SWITCH ROCKER SPST 15A 125V; Manufacturer 1: E-Switch; Switch Function: On-Off; Current Rating: 15A (AC); Actuator Type: Concave (Curved); Color - Actuator/Cap: Black; Actuator Marking: O I; Mechanical Life: 30,000 Cycles; Electrical Life: 10,000 Cycles; Supplier 1: Digi-Key; Supplier Part Number 1: EG2578-ND; Manufacturer Part Number 1: R1966ABLKBLKGR; RoHS: RoHS Compliant; Description 1: SWITCH ROCKER SPST 15A 125V; Category: Switches; Stock 1: 9; Pricing 1: 1=1.58, 10=1.507, 25=1.4384, 50=1.37, 100=1.3015, 250=1.26724, 500=1.19876, 1000=1.06175, 5000=1.0275 (USD); Packaging: Bulk; Part Status: Active; Circuit: SPST; Illumination Type, Color: -; Illumination Voltage (Nominal): -; Mounting Type: Panel Mount, Snap-In, Right Angle; Termination Style: PC Pin; Ingress Protection: -; Features: -; Panel Cutout Dimensions: Rectangular - 19.40mm x 13.00mm; Operating Temperature: -30°C ~ 65°C; ComponentLink1URL: http://spec_sheets.e-switch.com/specs/M301223.pdf; ComponentLink1Description: http://spec_sheets.e-switch.com/specs/M301223.pdf; Published: 24-Mar-1999; LatestRevisionDate: 17-Jul-2002; LatestRevisionNote: Re-released for DXP Platform.; PackageReference: SPST-2; Publisher: Altium Limited; PackageDescription: Switch; 2 Leads
S2 = FSMRA3JH: SWITCH TACTILE SPST-NO 0.05A 12V; Manufacturer: TE Connectivity; Switch Function: Off-Mom; Contact Rating @ Voltage: 0.05A @ 12VDC; Actuator Type: Standard; Actuator Height off PCB, from Pins: 5.85mm; Actuator Orientation: Side Actuated; Outline: 7.10mm x 7.00mm; Illumination: Non-Illuminated; Operating Force: 160gf; Actuator Material: Polyamide (PA), Nylon; Switch Travel: 0.25mm; Mechanical Life: 100,000 Cycles; .Creator: MM; .Checked PCB: CHK; Supplier 1: Digi-Key; Manufacturer Part Number: FSMRA3JH; RoHS: RoHS Compliant; Category: Switches; Stock 1: 37985; Pricing 1: 1=0.15, 10=0.143, 25=0.1376, 50=0.1328, 100=0.1255, 250=0.11808, 500=0.11316, 1000=0.0861 (USD); Packaging: Bulk; Circuit: SPST-NO; Mounting Type: Through Hole, Right Angle; Termination Style: PC Pin; Illumination Voltage (Nominal): -; Illumination Type, Color: -; Ingress Protection: -; Features: -; Operating Temperature: -35°C ~ 85°C; ComponentLink1URL: http://www.te.com/commerce/DocumentDelivery/DDEController?Action=srchrtrv&DocNm=1825027&DocType=Customer+Drawing&DocLang=English; ComponentLink1Description: http://www.te.com/commerce/DocumentDelivery/DDEController?Action=srchrtrv&DocNm=1825027&DocType=Customer+Drawing&DocLang=English; Supplier Part Number 1: 450-1657-ND; .Checked SCH: CHK
S3 = FSMRA2JH: SWITCH TACTILE SPST-NO 0.05A 24V; Manufacturer 1: TE Connectivity ALCOSWITCH Switches; Manufacturer Part Number 1: 1825027-5; .Checked PCB: MM; Switch Function: Off-Mom; Contact Rating @ Voltage: 0.05A @ 24VDC; Actuator Type: Standard; Actuator Length, Right Angle: 3.86mm; Actuator Orientation: Side Actuated; Outline: 7.10mm x 7.00mm; Illumination: Non-Illuminated; Operating Force: 160gf; Actuator Material: Polybutylene Terephthalate (PBT); Switch Travel: 0.25mm; Mechanical Life: 100,000 Cycles; .Checked SCH: MM; RoHS: RoHS Compliant; Stock 1: 37455; Pricing 1: 1=0.17, 10=0.169, 25=0.1628, 50=0.157, 100=0.1482, 250=0.13952, 500=0.1337, 1000=0.10173, 5000=0.08429 (USD); Packaging: Bulk; Part Status: Active; Circuit: SPST-NO; Mounting Type: Through Hole, Right Angle; Actuator Height off PCB, Vertical: -; Termination Style: PC Pin; Illumination Type, Color: -; Illumination Voltage (Nominal): -; Ingress Protection: -; Features: -; Operating Temperature: -35°C ~ 85°C; ComponentLink1URL: http://www.te.com/commerce/DocumentDelivery/DDEController?Action=srchrtrv&DocNm=1825027&DocType=Customer+Drawing&DocLang=English; ComponentLink1Description: http://www.te.com/commerce/DocumentDelivery/DDEController?Action=srchrtrv&DocNm=1825027&DocType=Customer+Drawing&DocLang=English; Supplier 1: Digi-Key; Supplier Part Number 1: 450-1662-ND; Description 1: SWITCH TACTILE SPST-NO 0.05A 24V; Category: Switches
TP1 TP2 TP4 = TP_25MILC: Test Point 25mil; .Checked PCB: CHK; .Checked SCH: CHK
U27 = ISL6236AIRZ: IC MAIN PWR CTRLR QUAD 32-QFN; Manufacturer: Intersil; .Checked PCB: CHK; Voltage - Input: 4.5 V ~ 25 V; Number of Outputs: 4; Voltage - Output: Multiple; .Checked SCH: CHK; Category: Integrated Circuits (ICs); Manufacturer Part Number: ISL6236AIRZ; Operating Temperature: -40°C ~ 100°C; Package / Case: 32-VFQFN Exposed Pad; Price 1k [$]: 3.0840; Value: ISL6236AIRZ; Family: PMIC - Voltage Regulators - Special Purpose; Supplier Part Number: ISL6236AIRZ-ND; Supplier: Digikey; Supplier 1: Digi-Key; Supplier Part Number 1: ISL6236AIRZ-ND; RoHS: RoHS Compliant; Stock 1: 0; Pricing 1: 600=4.28 (USD); Applications: Controller, Notebook Power System; Mounting Type: Surface Mount; Supplier Device Package: 32-QFN Exposed Pad (5x5); Packaging: Tube; ComponentLink1URL: http://www.intersil.com/data/fn/fn6453.pdf; ComponentLink1Description: http://www.intersil.com/data/fn/fn6453.pdf

## Sheet [06] - MICRO CONTROLLER CONNECTORS.SchDoc
size A1; Organization: Altium Limited; Address1: L3, 12a Rodborough Rd; Address2: Frenchs Forest; Address3: NSW; Address4: Australia 2086; DocumentNumber: 6; SheetNumber: 6; SheetTotal: 11
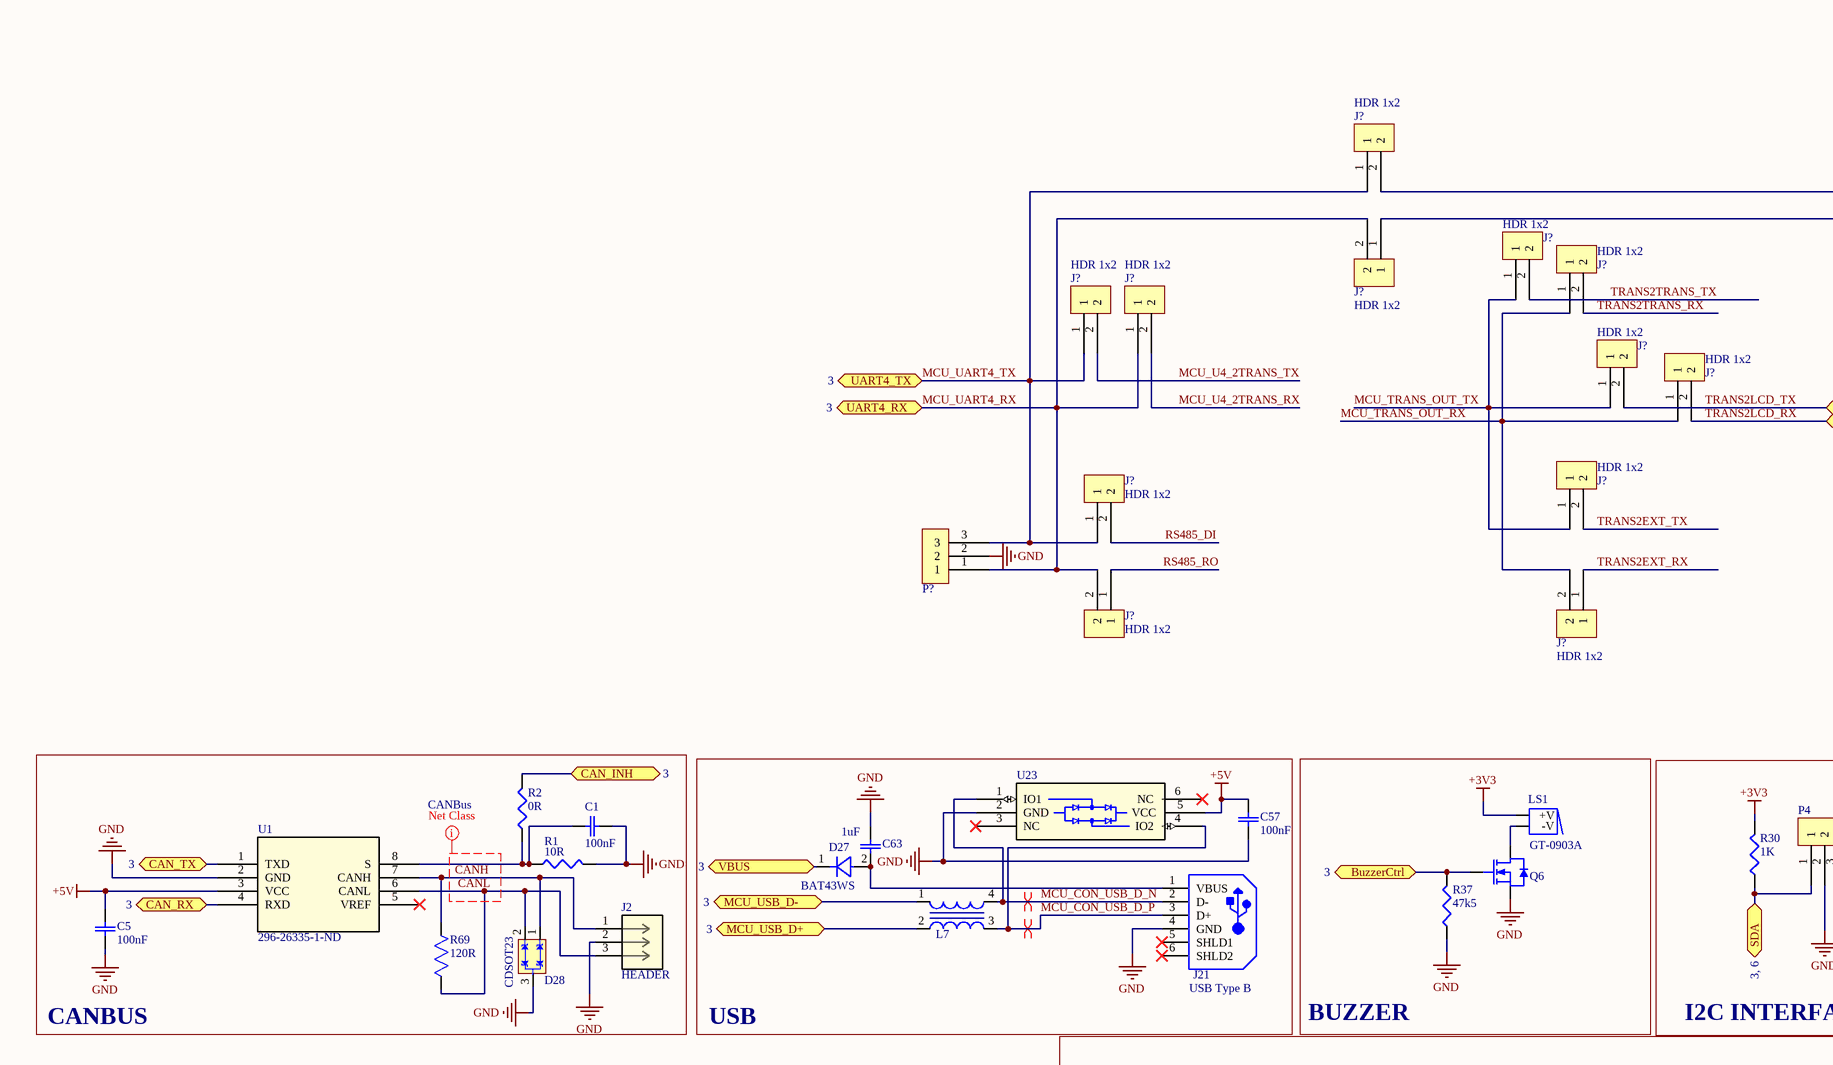
[diagram p6: [06] - MICRO CONTROLLER CONNECTORS.SchDoc, top left]
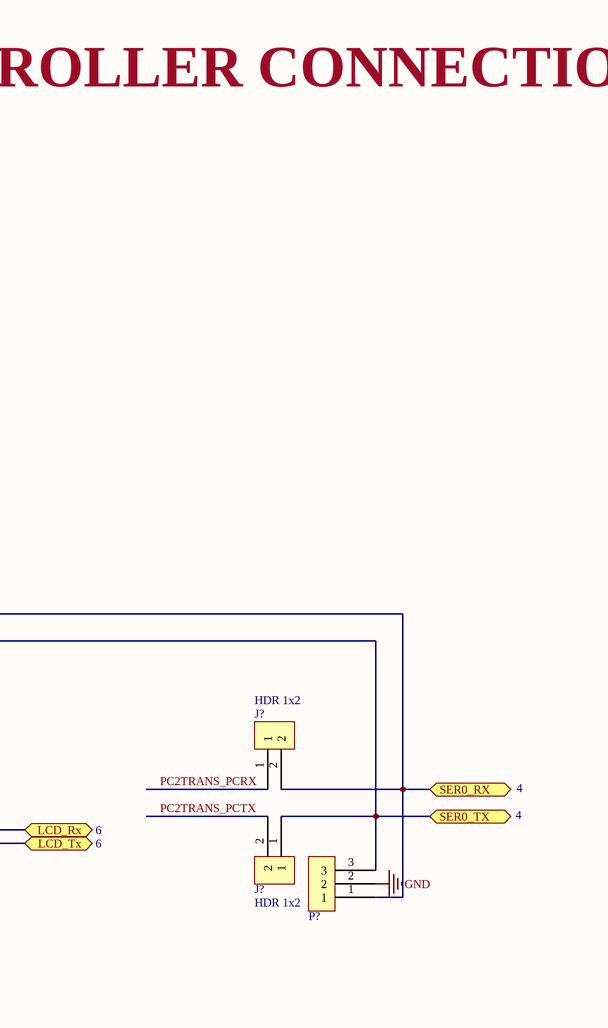
[diagram p7: [06] - MICRO CONTROLLER CONNECTORS.SchDoc, top right]
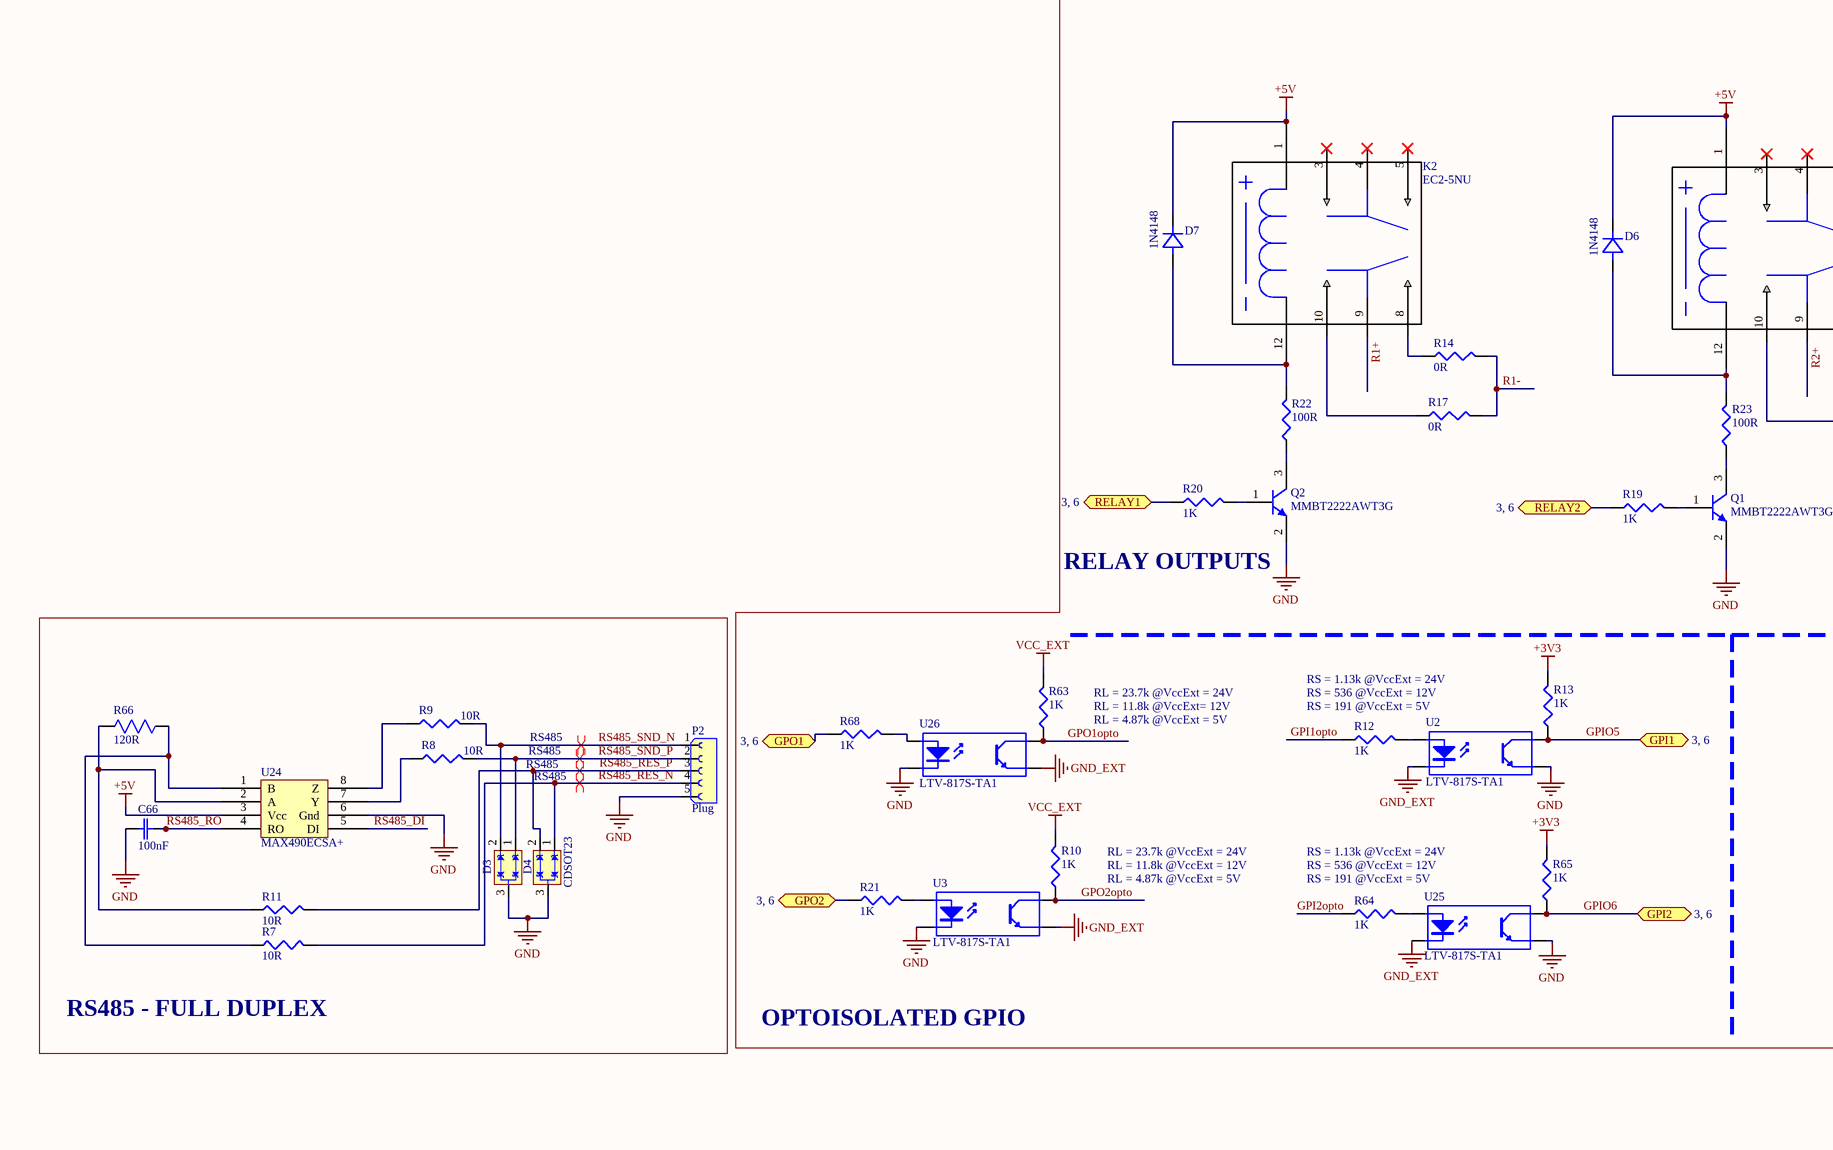
[diagram p8: [06] - MICRO CONTROLLER CONNECTORS.SchDoc, bottom left]
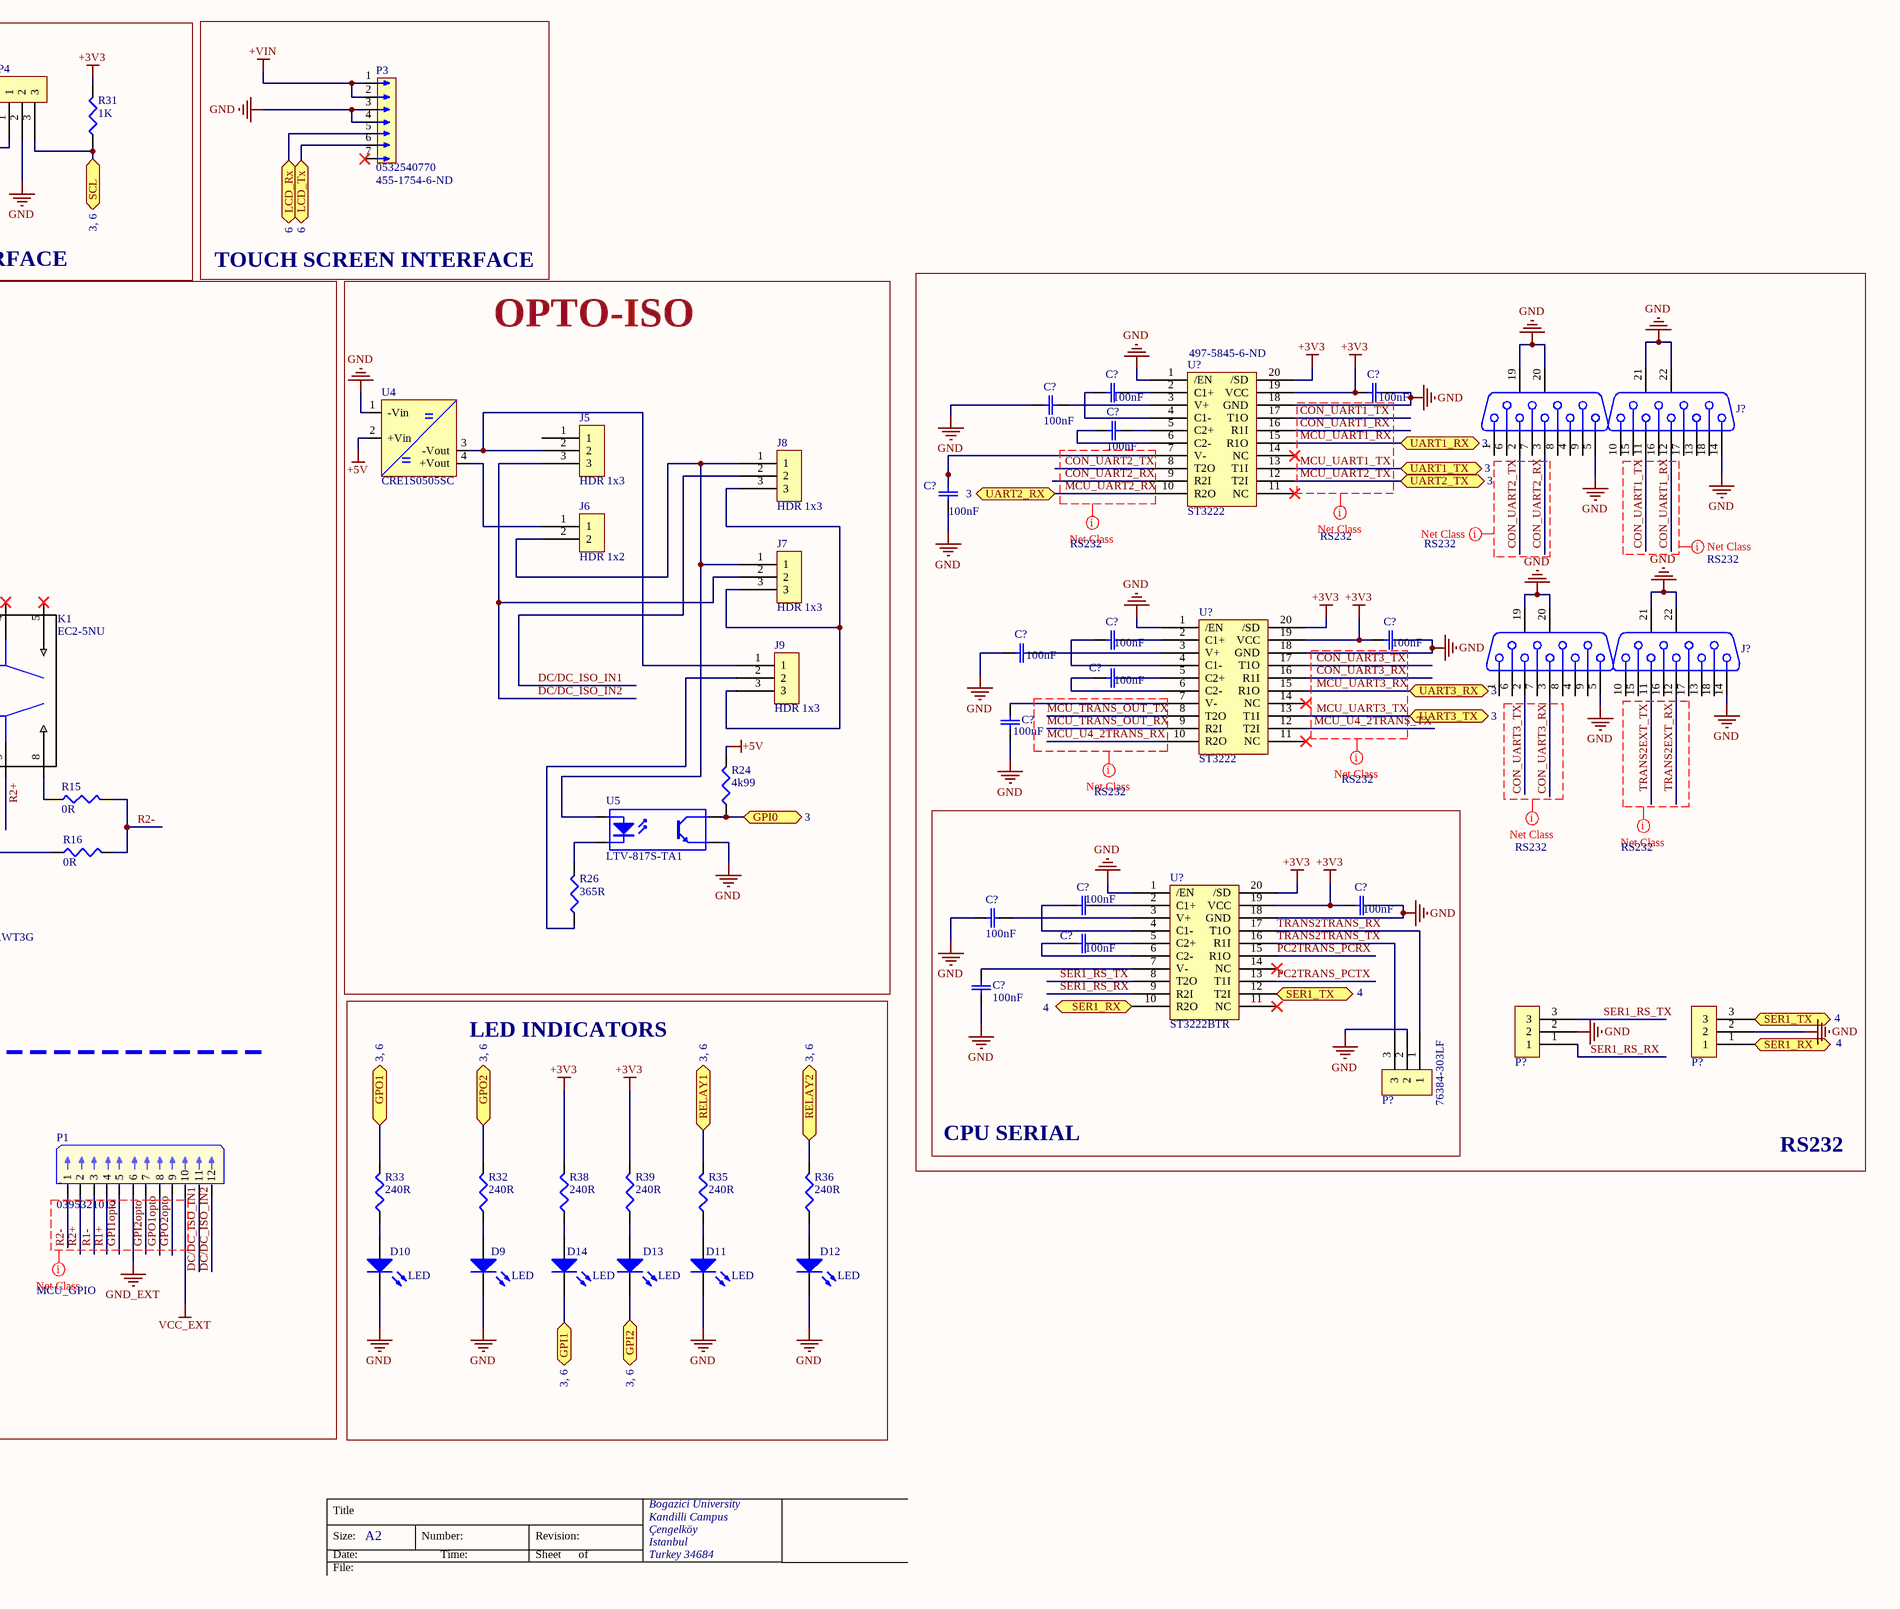
[diagram p9: [06] - MICRO CONTROLLER CONNECTORS.SchDoc, bottom right]

### Parts
(Parts that share a designator on the sheet are numbered #1, #2 ... from top to bottom, then left to right.)
C1#2  100nF  [C0402]
C5#2  100nF  [C0402]
C57  100nF  [C0402]
C63  1uF  [CAP_3216]
C66  100nF  [C0402]
C?#1  100nF  [C0402]
C?#2  100nF  [C0402]
C?#3  100nF  [C0402]
C?#4  100nF  [C0402]
C?#5  100nF  [C0402]
C?#6  100nF  [C0402]
C?#7  100nF  [C0402]
C?#8  100nF  [C0402]
C?#9  100nF  [C0402]
C?#10  100nF  [C0402]
C?#11  100nF  [C0402]
C?#12  100nF  [C0402]
C?#13  100nF  [C0402]
C?#14  100nF  [C0402]
C?#15  100nF  [C0402]
D3  CDSOT23  [SOT-23-3]  (value not drawn)
D4  CDSOT23  [SOT-23-3]
D6  1N4148  [SOD123-L]
D7  1N4148  [SOD123-L]
D9  LED  [D0603_Directional]
D10  LED  [D0603_Directional]
D11  LED  [D0603_Directional]
D12  LED  [D0603_Directional]
D13  LED  [D0603_Directional]
D14  LED  [D0603_Directional]
D27  BAT43WS  [SOD323]
D28  CDSOT23  [SOT-23-3]
J2  HEADER  [TerminalBlock3P508]
J5  HDR 1x3  [HDR_1X3_2.54MM]
J6  HDR 1x2  [HDR_1x2_2.54MM]
J7  HDR 1x3  [Hdr_1x3_2.54mm]
J8#2  HDR 1x3  [Hdr_1x3_2.54mm]
J9  HDR 1x3  [Hdr_1x3_2.54mm]
J21  USB Type B  [USB-B RECEPTACLE]
J?#1  HDR 1x2  [HDR_1x2_2.54MM]
J?#2  HDR 1x2  [HDR_1x2_2.54MM]
J?#3  HDR 1x2  [HDR_1x2_2.54MM]
J?#4  HDR 1x2  [HDR_1x2_2.54MM]
J?#5  HDR 1x2  [HDR_1x2_2.54MM]
J?#6  HDR 1x2  [HDR_1x2_2.54MM]
J?#7  HDR 1x2  [HDR_1x2_2.54MM]
J?#8  HDR 1x2  [HDR_1x2_2.54MM]
J?#9  HDR 1x2  [HDR_1x2_2.54MM]
J?#10  HDR 1x2  [HDR_1x2_2.54MM]
J?#11  HDR 1x2  [HDR_1x2_2.54MM]
J?#12  HDR 1x2  [HDR_1x2_2.54MM]
J?#13  HDR 1x2  [HDR_1x2_2.54MM]
J?#14  HDR 1x2  [HDR_1x2_2.54MM]
J?#15  DSUB-9 Stacked  [DSUB9-Double]  (value not drawn)
J?#16  DSUB-9 Stacked  [DSUB9-Double]  (value not drawn)
K1  EC2-5NU  [EC2NU]
K2  EC2-5NU  [EC2NU]
L7  ACM2012-900-2P-T002  [ACM2012]  (value not drawn)
LS1  GT-0903A  [GT-0903A]
P1  0395321012  [WM7852-ND]
P2  Plug  [691313710005]
P3  0532540770  Supplier Part Number 1: 455-1754-6-ND  [WM3412-ND]
P4  76384-303LF  [HDR_1x3_2.54MM_SHDR_V2]  (value not drawn)
P?#1  76384-303LF  [HDR_1x3_2.54MM_SHDR_V2]  (value not drawn)
P?#2  76384-303LF  [HDR_1x3_2.54MM_SHDR_V2]  (value not drawn)
P?#3  76384-303LF  [HDR_1x3_2.54MM_SHDR_V2]  (value not drawn)
P?#4  76384-303LF  [HDR_1x3_2.54MM_SHDR_V2]  (value not drawn)
P?#5  76384-303LF  [HDR_1X3_2.54MM_SHDR_V2]
Q1  MMBT2222AWT3G  [SC70_SOT323]
Q2  MMBT2222AWT3G  [SC70_SOT323]
Q6  MOSFET N-CH 20V 1A SOT323  [SC70_SOT323]  (value not drawn)
R1#2  10R  [R0402]
R2#2  0R  [R0402]
R7  10R  [R0402]
R8  10R  [R0402]
R9  10R  [R0402]
R10  1K  [R0402]
R11  10R  [R0402]
R12  1K  [R0402]
R13  1K  [R0402]
R14  0R  [R0402]
R15  0R  [R0402]
R16  0R  [R0402]
R17  0R  [R0402]
R19  1K  [R0402]
R20  1K  [R0402]
R21  1K  [R0402]
R22  100R  [R0402]
R23  100R  [R0402]
R24  4k99  [R0402]
R26  365R  [R0402]
R30  1K  [R0402]
R31  1K  [R0402]
R32  240R  [R0402]
R33  240R  [R0402]
R35  240R  [R0402]
R36  240R  [R0402]
R37  47k5  [R0402]
R38  240R  [R0402]
R39  240R  [R0402]
R63  1K  [R0402]
R64  1K  [R0402]
R65  1K  [R0402]
R66  120R  [RES_1632]
R68  1K  [R0402]
R69  120R  [RES_1632]
U1#2  296-26335-1-ND  [D8]
U2  LTV-817S-TA1  [4-SMD-opto]
U3  LTV-817S-TA1  [4-SMD-opto]
U4  CRE1S0505SC  [CRE1S0505SC]
U5  LTV-817S-TA1  [4-SMD-opto]
U23  TVS DIODE 5V 8.1V SOT23-6  [21-0058I]  (value not drawn)
U24  MAX490ECSA+  [21-0041B_8]
U25  LTV-817S-TA1  [4-SMD-opto]
U26  LTV-817S-TA1  [4-SMD-opto]
U?#1  ST3222  Supplier Part Number 1: 497-5845-6-ND  [TSSOP20]
U?#2  ST3222  [TSSOP20]
U?#3  ST3222BTR  [TSSOP20]

### Blocks framed on the sheet
CANBUS: C1#2 C5#2 D28 J2 R1#2 R2#2 R69 U1#2
USB: C57 C63 D27 J21 L7 U23
BUZZER: LS1 Q6 R37
I2C INTERFACE: P4 R30 R31
TOUCH SCREEN INTERFACE: P3
OPTO-ISO: J5-J7 J8#2 J9 R24 R26 U4 U5
RS232: C?#1-C?#10 J?#15 J?#16 P?#3 P?#4 U?#1 U?#2
CPU SERIAL: C?#11-C?#15 P?#5 U?#3
LED INDICATORS: D9-D14 R32 R33 R35 R36 R38 R39
RS485 - FULL DUPLEX: C66 D3 D4 P2 R7-R9 R11 R66 U24

### Ports
BuzzerCtrl (bidir, see 3), CAN_INH (bidir, see 3), CAN_RX (bidir, see 3), CAN_TX (bidir, see 3), GPI0 (bidir, see 3), GPI1 (bidir, see 3, 6), GPI2 (bidir, see 3, 6), GPO1 (bidir, see 3, 6), GPO2 (bidir, see 3, 6), LCD_Rx (bidir, see 6), LCD_Tx (bidir, see 6), MCU_USB_D+ (bidir, see 3), MCU_USB_D- (bidir, see 3), RELAY1 (bidir, see 3, 6), RELAY2 (bidir, see 3, 6), SCL (bidir, see 3, 6), SDA (bidir, see 3, 6), SER0_RX (bidir, see 4), SER0_TX (bidir, see 4), SER1_RX (bidir, see 4), SER1_TX (bidir, see 4), UART1_RX (bidir, see 3), UART1_TX (bidir, see 3), UART2_RX (bidir, see 3), UART2_TX (bidir, see 3), UART3_RX (bidir, see 3), UART3_TX (bidir, see 3), UART4_RX (bidir, see 3), UART4_TX (bidir, see 3), VBUS (see 3)

### Nets
+3V3: C?#2.1 C?#7.2 C?#12.2 LS1.1(+V) R13.2 R30.2 R31.2 R38.2 R39.2 R65.2 U?#1.19(VCC) U?#1.20(/SD) U?#2.19(VCC) U?#2.20(/SD) U?#3.19(VCC) U?#3.20(/SD)  [project net PWR_OUT2]
+5V: C5#2.2 C57.2 D6.1 D7.1 K1.1 K2.1 R24.2 U1#2.3(VCC) U4.2(+Vin) U23.5(VCC) U24.3(Vcc)
+VIN: P3.1 P3.2
GND: C1#2.2 C5#2.1 C57.1 C63.2 C66.1 C?#2.2 C?#3.1 C?#5.1 C?#7.1 C?#8.2 C?#10.2 C?#12.1 C?#13.1 C?#15.1 D3.3 D4.3 D9.2(K) D10.2(K) D11.2(K) D12.2(K) D28.3 J2.2 J21.4(GND) J?#15.5 J?#15.14 J?#15.19 J?#15.20 J?#15.21 J?#15.22 J?#16.5 J?#16.14 J?#16.19 J?#16.20 J?#16.21 J?#16.22 P2.5 P3.3 P3.4 P4.2 P?#1.2 P?#2.2 P?#3.2 P?#4.2 P?#5.2 Q1.2(E) Q2.2(E) Q6.2(S) R1#2.2 R37.1 U1#2.2(GND) U2.3(E) U3.2(K) U4.1(-Vin) U5.3(E) U23.2(GND) U24.6(Gnd) U25.3(E) U26.2(K) U?#1.1(/EN) U?#1.18(GND) U?#2.1(/EN) U?#2.18(GND) U?#3.1(/EN) U?#3.18(GND)
GND_EXT: P1.6 U2.2(K) U3.3(E) U25.2(K) U26.3(E)
VCC_EXT: P1.10 R10.2 R63.2
BUZZER_CRTL: Q6.1(G) R37.2 ; port BuzzerCtrl
CANH: D28.1 J2.1 R69.2 U1#2.7(CANH)
CANL: D28.2 J2.3 R69.1 U1#2.6(CANL)
CON_UART1_RX: J?#15.12 U?#1.16(R1I)
CON_UART1_TX: J?#15.11 U?#1.17(T1O)
CON_UART2_RX: J?#15.3 U?#1.9(R2I)
CON_UART2_TX: J?#15.2 U?#1.8(T2O)
CON_UART3_RX: J?#16.3 U?#2.16(R1I)
CON_UART3_TX: J?#16.2 U?#2.17(T1O)
DC/DC_ISO_IN1: J8#2.2 P1.11
DC/DC_ISO_IN2: J5.3 J7.2 P1.12
GPI1opto: P1.5 R12.1
GPI2opto: P1.7 R64.1
GPIO0: R24.1 U5.4(C) ; port GPI0
GPIO1: R33.2 R68.1 ; port GPO1
GPIO2: R21.1 R32.2 ; port GPO2
GPIO3: R20.1 R35.2 ; port RELAY1
GPIO4: R19.1 R36.2 ; port RELAY2
GPIO5: D14.2(K) R13.1 U2.4(C) ; port GPI1
GPIO6: D13.2(K) R65.1 U25.4(C) ; port GPI2
GPO1opto: P1.8 R63.1 U26.4(C)
GPO2opto: P1.9 R10.1 U3.4(C)
MCU_CAN_INH: R2#2.2 ; port CAN_INH
MCU_CAN_RX: U1#2.4(RXD) ; port CAN_RX
MCU_CAN_TX: U1#2.1(TXD) ; port CAN_TX
MCU_CON_USB_D_N: J21.2(D-) L7.4 U23.1(IO1)
MCU_CON_USB_D_P: J21.3(D+) L7.3 U23.4(IO2)
MCU_TRANS_OUT_RX: J?#3.1 J?#9.1 J?#14.2 U?#2.9(R2I)
MCU_TRANS_OUT_TX: J?#2.1 J?#8.1 J?#11.1 U?#2.8(T2O)
MCU_U4_2TRANS_RX: J?#6.2 U?#2.10(R2O)
MCU_U4_2TRANS_TX: J?#5.2 U?#2.12(T2I)
MCU_UART1_RX: U?#1.15(R1O) ; port UART1_RX
MCU_UART1_TX: U?#1.13(T1I) ; port UART1_TX
MCU_UART2_RX: U?#1.10(R2O) ; port UART2_RX
MCU_UART2_TX: U?#1.12(T2I) ; port UART2_TX
MCU_UART3_RX: U?#2.15(R1O) ; port UART3_RX
MCU_UART3_TX: U?#2.13(T1I) ; port UART3_TX
MCU_UART4_RX: J?#4.2 J?#6.1 J?#13.2 P?#2.1 ; port UART4_RX
MCU_UART4_TX: J?#1.1 J?#5.1 J?#12.1 P?#2.3 ; port UART4_TX
MCU_USB_D_N: L7.1 ; port MCU_USB_D-
MCU_USB_D_P: L7.2 ; port MCU_USB_D+
PC2TRANS_PCRX: J?#7.1 U?#3.15(R1O)
PC2TRANS_PCTX: J?#10.2 U?#3.13(T1I)
R1+: K2.9 P1.4
R1-: P1.3 R14.2 R17.2
R2+: K1.9 P1.2
R2-: P1.1 R15.2 R16.2
RS485_DI: J?#12.2 U24.5(DI)
RS485_RES_N: D4.1 P2.4 R7.2
RS485_RES_P: D4.2 P2.3 R11.2
RS485_RO: C66.2 J?#13.1 U24.4(RO)
RS485_SND_N: D3.2 P2.1 R9.2
RS485_SND_P: D3.1 P2.2 R8.2
SER1_RS_RX: P?#3.1 U?#3.9(R2I)
SER1_RS_TX: P?#3.3 U?#3.8(T2O)
TRANS2EXT_RX: J?#14.1 J?#16.12
TRANS2EXT_TX: J?#11.2 J?#16.11
TRANS2LCD_RX: J?#9.2 P3.6 ; port LCD_Tx
TRANS2LCD_TX: J?#8.2 P3.5 ; port LCD_Rx
TRANS2TRANS_RX: J?#3.2 P?#5.1 U?#3.17(T1O)
TRANS2TRANS_TX: J?#2.2 P?#5.3 U?#3.16(R1I)
VBUS: D27.1 ; port VBUS
NetC1#2_1: C1#2.1 R1#2.1 R2#2.1 U1#2.8(S)
NetC63_1: C63.1 D27.2 J21.1(VBUS)
NetC?#1_1: C?#1.1 U?#1.4(C1-)
NetC?#1_2: C?#1.2 U?#1.2(C1+)
NetC?#3_2: C?#3.2 U?#1.3(V+)
NetC?#4_1: C?#4.1 U?#1.6(C2-)
NetC?#4_2: C?#4.2 U?#1.5(C2+)
NetC?#5_2: C?#5.2 U?#1.7(V-)
NetC?#6_1: C?#6.1 U?#2.2(C1+)
NetC?#6_2: C?#6.2 U?#2.4(C1-)
NetC?#8_1: C?#8.1 U?#2.3(V+)
NetC?#9_1: C?#9.1 U?#2.5(C2+)
NetC?#9_2: C?#9.2 U?#2.6(C2-)
NetC?#10_1: C?#10.1 U?#2.7(V-)
NetC?#11_1: C?#11.1 U?#3.2(C1+)
NetC?#11_2: C?#11.2 U?#3.4(C1-)
NetC?#13_2: C?#13.2 U?#3.3(V+)
NetC?#14_1: C?#14.1 U?#3.5(C2+)
NetC?#14_2: C?#14.2 U?#3.6(C2-)
NetC?#15_2: C?#15.2 U?#3.7(V-)
NetD6_2: D6.2 K1.12 R23.2
NetD7_2: D7.2 K2.12 R22.2
NetD9_1: D9.1(A) R32.1
NetD10_1: D10.1(A) R33.1
NetD11_1: D11.1(A) R35.1
NetD12_1: D12.1(A) R36.1
NetD13_1: D13.1(A) R39.1
NetD14_1: D14.1(A) R38.1
NetJ5_2: J5.2 J9.1 U4.3(-Vout)
NetJ6_1: J6.1 U4.4(+Vout)
NetJ6_2: J6.2 J7.1 J8#2.1 U5.1(A)
NetJ7_3: J7.3 J8#2.3 J9.3
NetJ9_2: J9.2 R26.1
NetJ?#1_2: J?#1.2 J?#7.2 P?#1.1 ; port SER0_RX
NetJ?#4_1: J?#4.1 J?#10.1 P?#1.3 ; port SER0_TX
NetK1_8: K1.8 R15.1
NetK1_10: K1.10 R16.1
NetK2_8: K2.8 R14.1
NetK2_10: K2.10 R17.1
NetLS1_2: LS1.2(-V) Q6.3(D)
NetP4_1: P4.1 R30.1 ; port SDA
NetP4_3: P4.3 R31.1 ; port SCL
NetP?#4_1: P?#4.1 U?#3.10(R2O) ; port SER1_RX
NetP?#4_3: P?#4.3 U?#3.12(T2I) ; port SER1_TX
NetQ1_1: Q1.1(B) R19.2
NetQ1_3: Q1.3(C) R23.1
NetQ2_1: Q2.1(B) R20.2
NetQ2_3: Q2.3(C) R22.1
NetR7_1: R7.1 R66.2 U24.1(B)
NetR8_1: R8.1 U24.7(Y)
NetR9_1: R9.1 U24.8(Z)
NetR11_1: R11.1 R66.1 U24.2(A)
NetR12_2: R12.2 U2.1(A)
NetR21_2: R21.2 U3.1(A)
NetR26_2: R26.2 U5.2(K)
NetR64_2: R64.2 U25.1(A)
NetR68_2: R68.2 U26.1(A)

Not connected (* = marked no-connect by the designer): J5 1; J21 5(SHLD1)* 6(SHLD2)*; J?#15 1 4 6 7 8 9 10 13 15 16 17 18; J?#16 1 4 6 7 8 9 10 13 15 16 17 18; K1 3 4 5; K2 3 4 5; P3 7*; U1#2 5(VREF)*; U23 3(NC)* 6(NC)*; U?#1 11(NC)* 14(NC)*; U?#2 11(NC)* 14(NC)*; U?#3 11(NC)* 14(NC)*

### Layout directives
net class CANBus: CANH, CANL
differential pair; net class MCU_USB: MCU_CON_USB_D_N, MCU_CON_USB_D_P
net class MCU_GPIO: GPI1opto, GPI2opto, GPO1opto, GPO2opto, R1+, R1-, R2+, R2-
differential pair; net class RS485: RS485_RES_N, RS485_RES_P, RS485_SND_N, RS485_SND_P
net class RS232: CON_UART1_RX, CON_UART1_TX, CON_UART2_RX, CON_UART2_TX, CON_UART3_RX, CON_UART3_TX, MCU_TRANS_OUT_RX, MCU_TRANS_OUT_TX, MCU_U4_2TRANS_RX, MCU_U4_2TRANS_TX, MCU_UART1_RX, MCU_UART1_TX, MCU_UART2_RX, MCU_UART2_TX, MCU_UART3_RX, MCU_UART3_TX, TRANS2EXT_RX, TRANS2EXT_TX

### Notes on the sheet
- MICRO-CONTROLLER CONNECTIONS
- RELAY OUTPUTS
- RL = 23.7k @VccExt = 24V
- RL = 11.8k @VccExt= 12V
- RL = 4.87k @VccExt = 5V
- RS = 1.13k @VccExt = 24V
- RS = 536 @VccExt = 12V
- RS = 191 @VccExt = 5V
- RL = 11.8k @VccExt = 12V
- OPTOISOLATED GPIO
- Title
- Bogazici University
- Size:
- Date:
- File:
- A2
- Number:
- Time:
- Revision:
- Sheet
- of
- Kandilli Campus
- Çengelköy
- Istanbul
- Turkey 34684